# Altium project IIOT_GATEWAY_MT7621.PrjPcb (part 1 of 2)
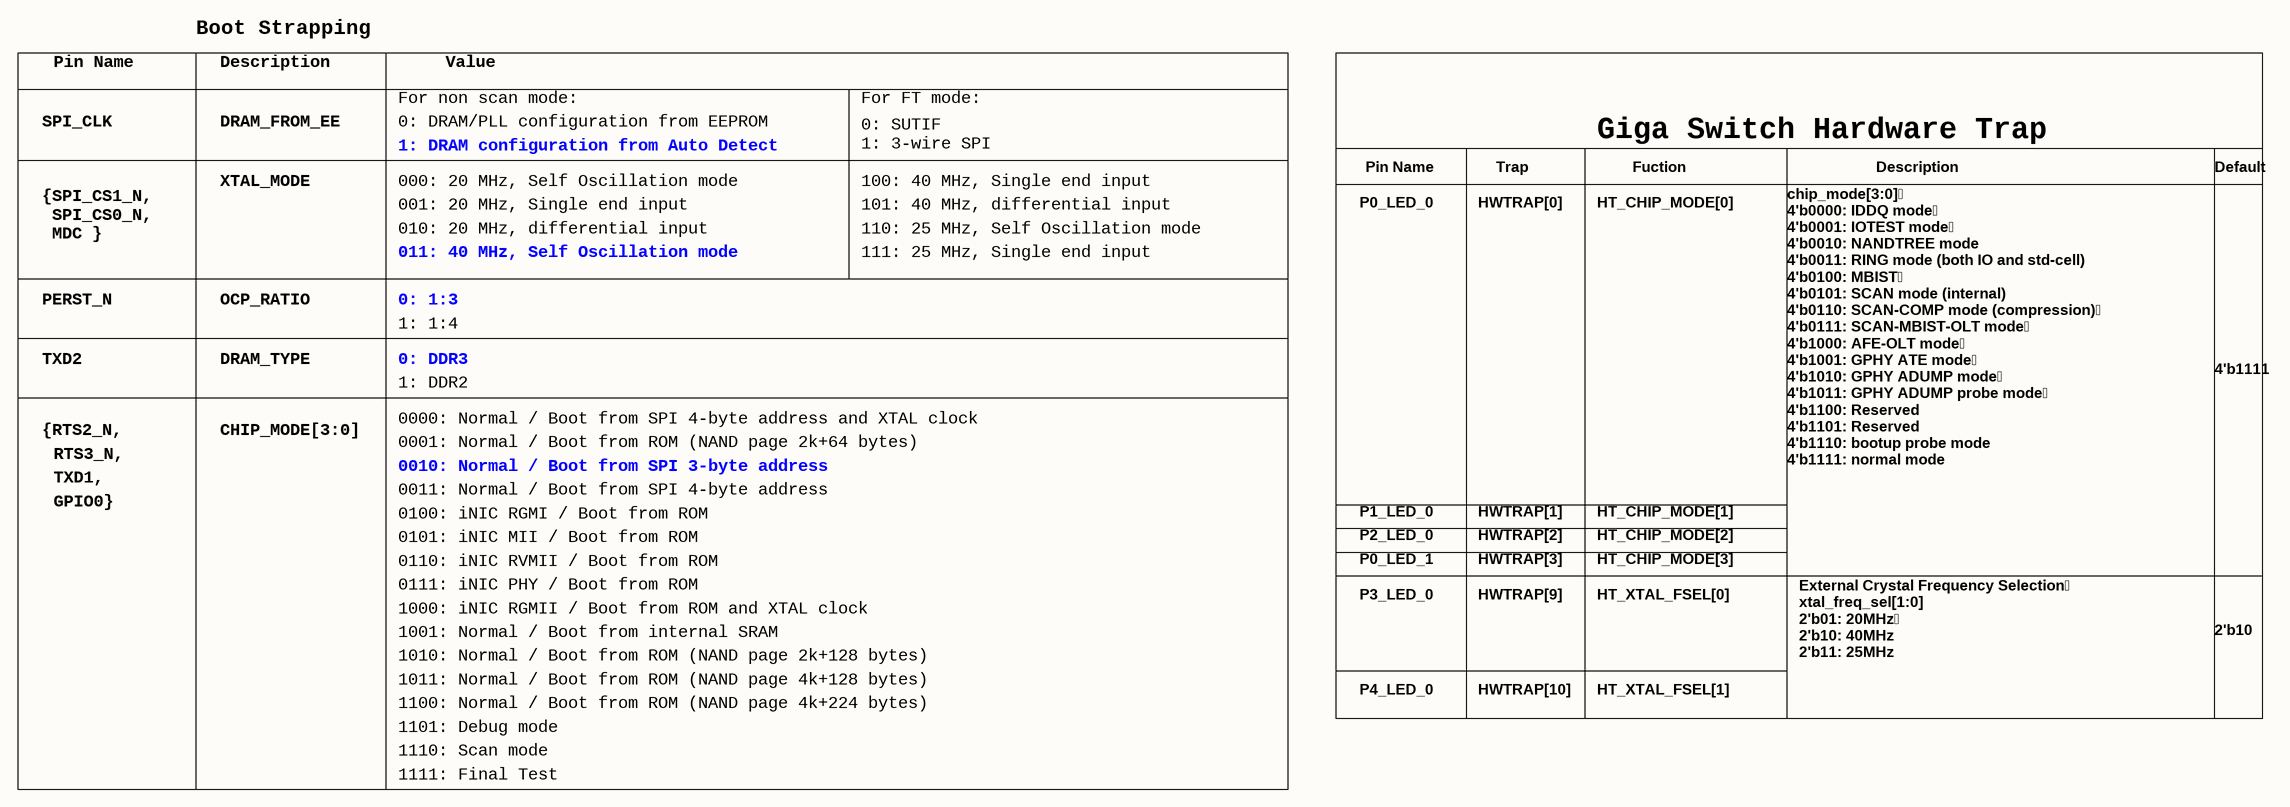
[diagram p0: Config.SchDoc]
9 sheets, 340 parts. Net scope: global (net labels, ports and power ports of the same name join across sheets).
Board file: IIOT_GATEWAY_MT7621.PcbDoc
Sheets:
  Config.SchDoc
  DC_DC_ISO.SchDoc
  PMU.SchDoc
  TRANSFORMER_RJ45.SchDoc
  USB3.0_Console.SchDoc
  uSD.SchDoc
  PCIe to SATA.SchDoc
  PCIe Slot.SchDoc
  RS485.SchDoc

## Sheet Config.SchDoc
size 513 x 386 mm

### Notes on the sheet
- Pin Name
- Boot Strapping
- Description
- Value
- SPI_CLK
- DRAM_FROM_EE
- For non scan mode:
- 0: DRAM/PLL configuration from EEPROM
- For FT mode:
- XTAL_MODE
- 1: DRAM configuration from Auto Detect
- 000: 20 MHz, Self Oscillation mode
- 100: 40 MHz, Single end input
- 0: SUTIF
  1: 3-wire SPI
- Trap
- Giga Switch Hardware Trap
- Fuction
- Default
- {SPI_CS1_N,
  SPI_CS0_N,
  MDC }
- 001: 20 MHz, Single end input
- 010: 20 MHz, differential input
- 101: 40 MHz, differential input
- 110: 25 MHz, Self Oscillation mode
- P0_LED_0
- HWTRAP[0]
- HT_CHIP_MODE[0]
- PERST_N
- OCP_RATIO
- 0: 1:3
- 011: 40 MHz, Self Oscillation mode
- 111: 25 MHz, Single end input
- TXD2
- DRAM_TYPE
- 0: DDR3
- 1: 1:4
- 4'b1111
- 1: DDR2
- 0000: Normal / Boot from SPI 4-byte address and XTAL clock
- {RTS2_N,
- RTS3_N,
- TXD1,
- CHIP_MODE[3:0]
- 0001: Normal / Boot from ROM (NAND page 2k+64 bytes)
- 0010: Normal / Boot from SPI 3-byte address
- chip_mode[3:0]
  4'b0000: IDDQ mode
  4'b0001: IOTEST mode
  4'b0010: NANDTREE mode
  4'b0011: RING mode (both IO and std-cell)
  4'b0100: MBIST
  4'b0101: SCAN mode (internal)
  4'b0110: SCAN-COMP mode (compression)
  4'b0111: SCAN-MBIST-OLT mode
  4'b1000: AFE-OLT mode
  4'b1001: GPHY ATE mode
  4'b1010: GPHY ADUMP mode
  4'b1011: GPHY ADUMP probe mode
  4'b1100: Reserved
  4'b1101: Reserved
  4'b1110: bootup probe mode
  4'b1111: normal mode
- GPIO0}
- 0011: Normal / Boot from SPI 4-byte address
- 0100: iNIC RGMI / Boot from ROM
- 0101: iNIC MII / Boot from ROM
- P1_LED_0
- P2_LED_0
- HWTRAP[1]
- HWTRAP[2]
- HT_CHIP_MODE[2]
- HT_CHIP_MODE[1]
- 0111: iNIC PHY / Boot from ROM
- 0110: iNIC RVMII / Boot from ROM
- P0_LED_1
- P3_LED_0
- HWTRAP[9]
- HWTRAP[3]
- HT_XTAL_FSEL[0]
- HT_CHIP_MODE[3]
- 1000: iNIC RGMII / Boot from ROM and XTAL clock
- 1001: Normal / Boot from internal SRAM
- 1010: Normal / Boot from ROM (NAND page 2k+128 bytes)
- External Crystal Frequency Selection
  xtal_freq_sel[1:0]
  2'b01: 20MHz
  2'b10: 40MHz
  2'b11: 25MHz
- 2'b10
- 1100: Normal / Boot from ROM (NAND page 4k+224 bytes)
- 1011: Normal / Boot from ROM (NAND page 4k+128 bytes)
- P4_LED_0
- HWTRAP[10]
- HT_XTAL_FSEL[1]
- 1101: Debug mode
- 1110: Scan mode
- 1111: Final Test

## Sheet DC_DC_ISO.SchDoc
size Legal
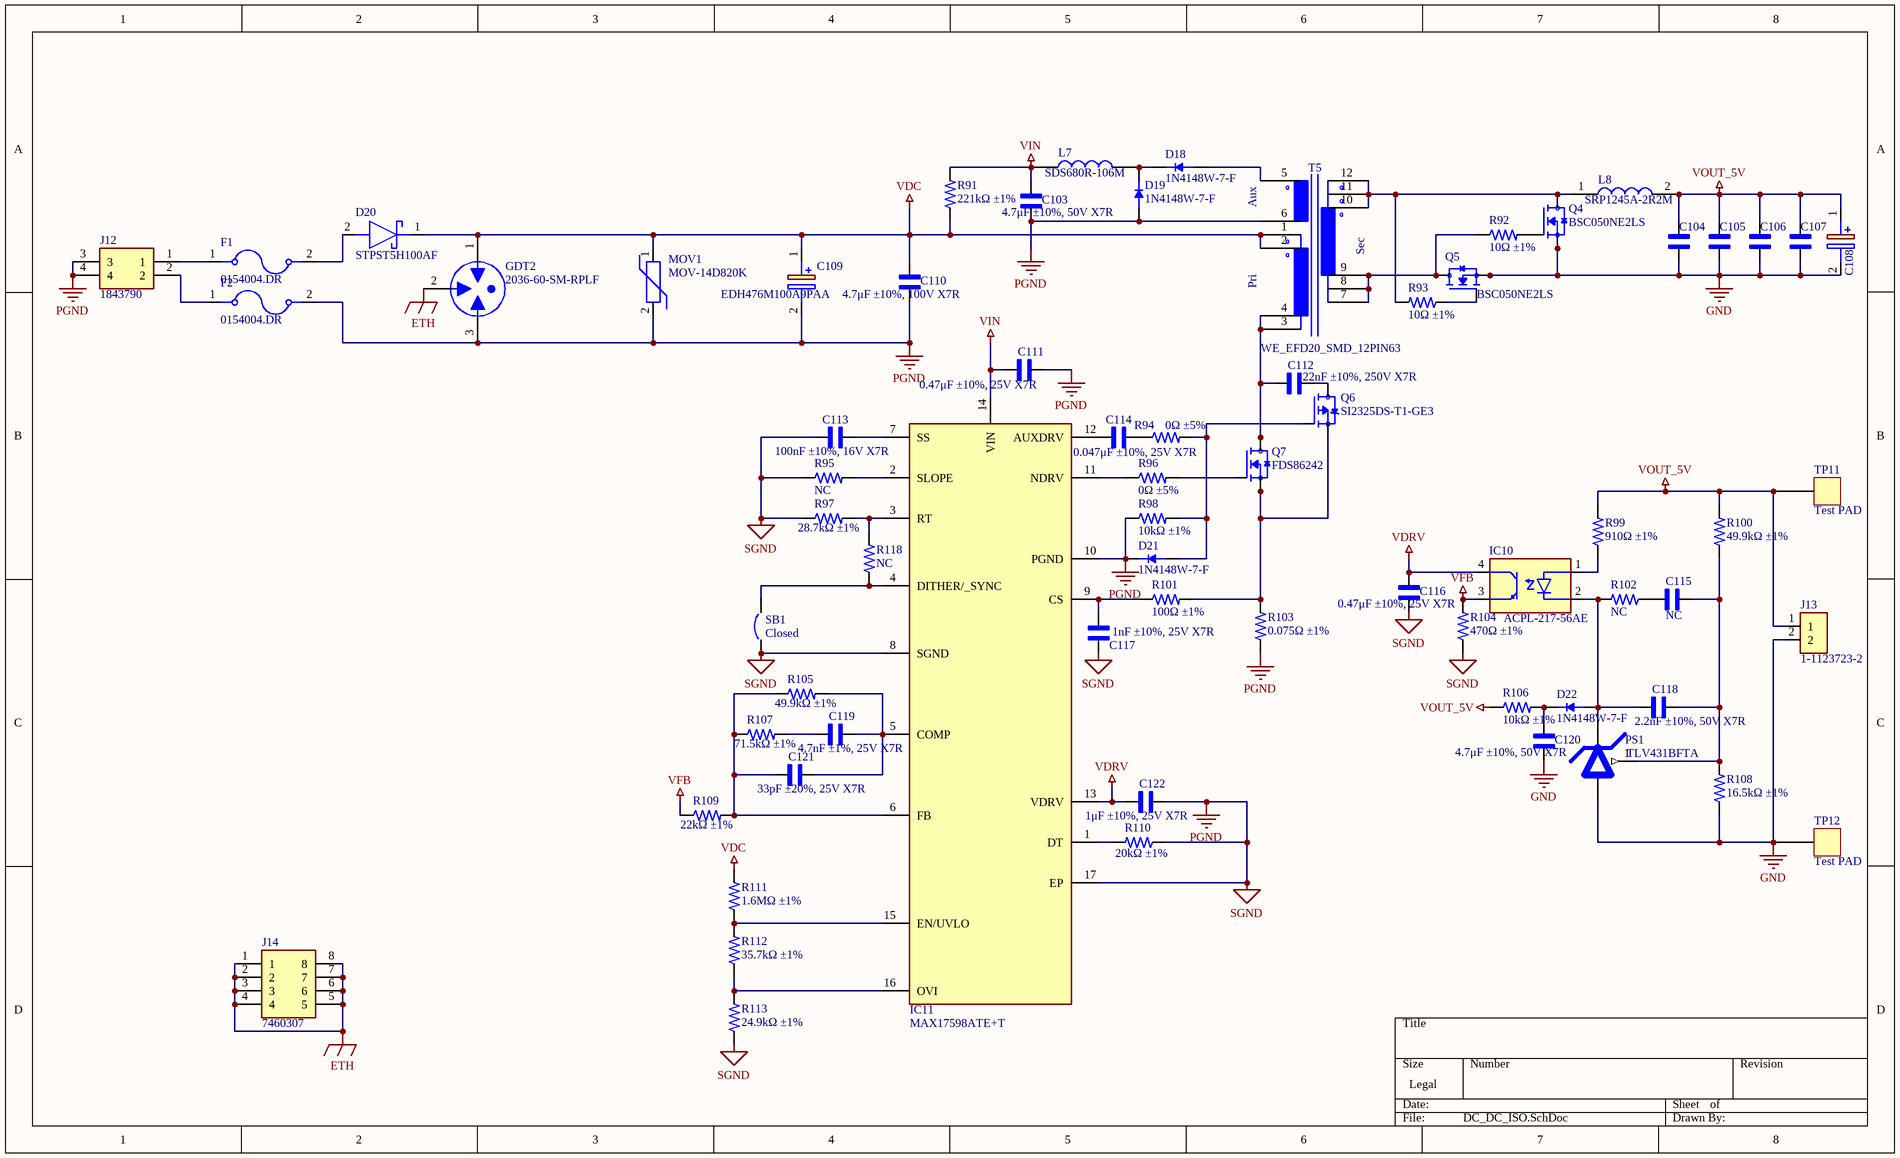
[diagram p1: DC_DC_ISO.SchDoc]

### Parts
C103  4.7μF ±10%, 50V X7R  [1206_C]
C104  47μF ±10%, 10V X7R  [1210_C]  (value not drawn)
C105  47μF ±10%, 10V X7R  [1210_C]  (value not drawn)
C106  47μF ±10%, 10V X7R  [1210_C]  (value not drawn)
C107  47μF ±10%, 10V X7R  [1210_C]  (value not drawn)
C108  TCJ5477M016R0100E/NI  [CAPPM7344X400N]  (value not drawn)
C109  EDH476M100A9PAA  [CAPAE1030X1050N]
C110  4.7μF ±10%, 100V X7R  [1210_C]
C111  0.47μF ±10%, 25V X7R  [0603_C]
C112  22nF ±10%, 250V X7R  [0805_C]
C113  100nF ±10%, 16V X7R  [0603_C]
C114  0.047μF ±10%, 25V X7R  [0603_C]
C115  NC  [0603_C]
C116  0.47μF ±10%, 25V X7R  [0603_C]
C117  1nF ±10%, 25V X7R  [0603_C]
C118  2.2nF ±10%, 50V X7R  [0603_C]
C119  4.7nF ±1%, 25V X7R  [0603_C]
C120  4.7μF ±10%, 50V X7R  [1206_C]
C121  33pF ±20%, 25V X7R  [0603_C]
C122  1μF ±10%, 25V X7R  [0805_C]
D18  1N4148W-7-F  [SOD3715X135N]
D19  1N4148W-7-F  [SOD3715X135N]
D20  STPST5H100AF  [SODFL4724X103N]
D21  1N4148W-7-F  [SOD3715X135N]
D22  1N4148W-7-F  [SOD3715X135N]
F1  0154004.DR  [FUSE_0154004.DR]
F2  0154004.DR  [FUSE_0154004.DR]
GDT2  2036-60-SM-RPLF  [2036-60-SM-RPLF]
IC10  ACPL-217-56AE  [SOIC127P700X242-4N]
IC11  MAX17598ATE+T  [QFN50P300X300X80-17N]
J12  1843790  [1843790]
J13  1-1123723-2  [TE_1-1123723-2]
J14  7460307  [7460307]
L7  SDS680R-106M  [SRR6603332ML]
L8  SRP1245A-2R2M  [INDPM135125X500N]
MOV1  MOV-14D820K  [MOV-14D820K]
PS1  TLV431BFTA  [SOT96P240X100-3N]
Q4  BSC050NE2LS  [BSC050NE2LS]
Q5  BSC050NE2LS  [BSC050NE2LS]
Q6  SI2325DS-T1-GE3  [SOT-23]
Q7  FDS86242  [SOIC127P600X175-8N]
R91  221kΩ ±1%  [0805_R]
R92  10Ω ±1%  [0603_R]
R93  10Ω ±1%  [0603_R]
R94  0Ω ±5%  [0603_R]
R95  NC  [0603_R]
R96  0Ω ±5%  [0603_R]
R97  28.7kΩ ±1%  [0603_R]
R98  10kΩ ±1%  [0603_R]
R99  910Ω ±1%  [0603_R]
R100  49.9kΩ ±1%  [0603_R]
R101  100Ω ±1%  [0603_R]
R102  NC  [0603_R]
R103  0.075Ω ±1%  [1206_R]
R104  470Ω ±1%  [0603_R]
R105  49.9kΩ ±1%  [0603_R]
R106  10kΩ ±1%  [0603_R]
R107  71.5kΩ ±1%  [0603_R]
R108  16.5kΩ ±1%  [0603_R]
R109  22kΩ ±1%  [0603_R]
R110  20kΩ ±1%  [0603_R]
R111  1.6MΩ ±1%  [0805_R]
R112  35.7kΩ ±1%  [0603_R]
R113  24.9kΩ ±1%  [0603_R]
R118  NC  [0603_R]
SB1  Closed  [SB_0603]
T5  WE_EFD20_SMD_12PIN63  [WE_EFD20_SMD_12PIN63]
TP11  Test PAD  [Test PAD]
TP12  Test PAD  [Test PAD]

### Nets
ETH: GDT2.2(E) J14.1 J14.2 J14.3 J14.4 J14.5 J14.6 J14.7 J14.8
GND: C104.2 C105.2 C106.2 C107.2 C108.2(-) C120.2 J13.2 PS1.3(ANODE) Q4.1(S) Q4.2(S) Q4.3(S) Q5.1(S) Q5.2(S) Q5.3(S) R108.1 TP12.1
PGND: C103.2 C109.2(-) C110.2 C111.2 C113.1 C116.2 C117.2 C122.2 D19.A D21.C(K) F2.2 GDT2.3(B) IC11.8(SGND) IC11.10(PGND) IC11.17(EP) J12.3 J12.4 MOV1.2 R95.1 R97.1 R98.1 R103.1 R104.1 R110.1 R113.1 SB1.1 T5.6  [also labelled SGND]
VDC: C109.1(+) C110.1 D20.1(K) GDT2.1(A) MOV1.1 R91.1 R111.2 T5.1 T5.2
VDRV: C116.1 C122.1 IC10.4(COLLECTOR) IC11.13(VDRV)
VFB: IC10.3(EMITTER) R104.2 R109.1
VIN: C103.1 C111.1 IC11.14(VIN) L7.1 R91.2
VOUT_5V: C104.1 C105.1 C106.1 C107.1 C108.1(+) J13.1 L8.2 R99.2 R100.2 R106.1 TP11.1
NetC112_1: C112.1 Q6.3(D)
NetC112_2: C112.2 Q7.5(D) Q7.6(D) Q7.7(D) Q7.8(D) T5.3 T5.4
NetC113_2: C113.2 IC11.7(SS)
NetC114_1: C114.1 R94.1
NetC114_2: C114.2 IC11.12(AUXDRV)
NetC115_1: C115.1 C118.1 PS1.1(REF) R100.1 R108.2
NetC115_2: C115.2 R102.1
NetC117_1: C117.1 IC11.9(CS) R101.1
NetC118_2: C118.2 D22.A IC10.2(CATHODE) PS1.2(CATHODE) R102.2
NetC119_1: C119.1 R107.2
NetC119_2: C119.2 C121.2 IC11.5(COMP) R105.2
NetC120_1: C120.1 D22.C(K) R106.2
NetC121_1: C121.1 IC11.6(FB) R105.1 R107.1 R109.2
NetD18_A: D18.A T5.5
NetD18_C: D18.C(K) D19.C(K) L7.2
NetD20_2: D20.2(A) F1.2
NetD21_A: D21.A Q6.1(G) R94.2 R98.2
NetF1_1: F1.1 J12.1
NetF2_1: F2.1 J12.2
NetIC10_1: IC10.1(ANODE) R99.1
NetIC11_1: IC11.1(DT) R110.2
NetIC11_2: IC11.2(SLOPE) R95.2
NetIC11_3: IC11.3(RT) R97.2 R118.2
NetIC11_4: IC11.4(DITHER/_SYNC) R118.1 SB1.2
NetIC11_11: IC11.11(NDRV) R96.1
NetIC11_15: IC11.15(EN/UVLO) R111.1 R112.2
NetIC11_16: IC11.16(OVI) R112.1 R113.2
NetL8_1: L8.1 Q4.5(D) Q4.6(D) Q4.7(D) Q4.8(D) Q4.9(D) R93.2 T5.10 T5.11 T5.12
NetQ4_4: Q4.4(G) R92.2
NetQ5_4: Q5.4(G) R93.1
NetQ5_5: Q5.5(D) Q5.6(D) Q5.7(D) Q5.8(D) Q5.9(D) R92.1 T5.7 T5.8 T5.9
NetQ6_2: Q6.2(S) Q7.1(S) Q7.2(S) Q7.3(S) R101.2 R103.2
NetQ7_4: Q7.4(G) R96.2

### Notes on the sheet
- (in symbol WE_EFD20_SMD_12PIN63) Aux; Sec; Pri

### Library data of the parts
C103 C110-C122 = CAP: MP: LD03ZD475MAB2A; Package: None; Price: None; Value: *; Availability: Unavailable
C104-C107 = CAP: Capacitor non polar; MP: LD03ZD475MAB2A; Package: None; Price: None; Value: *; Availability: Unavailable
C108 = TCJ5477M016R0100E: Capacitor Polarised; Manufacturer_Name: AVX; Datasheet Link: https://datasheets.kyocera-avx.com/TCJ.pdf; Height: 4mm; Manufacturer_Part_Number: TCJ5477M016R0100E; Mouser Part Number: 581-TCJ5477M016R100E; Mouser Price/Stock: https://www.mouser.co.uk/ProductDetail/AVX/TCJ5477M016R0100E?qs=hWgE7mdIu5QV3CO1kSXQRw%3D%3D
C109 = EDH476M100A9PAA: Capacitor Polarised; Manufacturer_Name: KEMET; Datasheet Link: https://content.kemet.com/datasheets/KEM_A4049_EDH.pdf; Height: 10.5mm; Manufacturer_Part_Number: EDH476M100A9PAA; Mouser Part Number: 80-EDH476M100A9PAA; Mouser Price/Stock: https://www.mouser.co.uk/ProductDetail/KEMET/EDH476M100A9PAA?qs=E9QF1UCAUX7o%252BSuv4vgBDA%3D%3D; Arrow Part Number: EDH476M100A9PAA; Arrow Price/Stock: https://www.arrow.com/en/products/edh476m100a9paa/kemet-corporation?region=nac
D18 D19 D21 D22 = 1N4148W-7-F: Diode Standard 100 V 300mA (DC) Surface Mount SOD-123; MF: Diodes Inc.; Value: *; Availability: In Stock; Package: SOD-123 Fairchild Semiconductor; SnapEDA_Link: https://www.snapeda.com/parts/1N4148W-7-F/Diodes+Inc./view-part/?ref=snap; Price: None; Check_prices: https://www.snapeda.com/parts/1N4148W-7-F/Diodes+Inc./view-part/?ref=eda; Purchase-URL: https://pricing.snapeda.com/search/part/1N4148W-7-F/?ref=eda; MP: 1N4148W-7-F
D20 = STPST5H100AF: Schottky Diode; Manufacturer_Name: STMicroelectronics; Datasheet Link: https://www.st.com/resource/en/datasheet/stpst5h100.pdf; Height: 1.03mm; Manufacturer_Part_Number: STPST5H100AF; Mouser Part Number: 511-STPST5H100AF; Mouser Price/Stock: https://www.mouser.co.uk/ProductDetail/STMicroelectronics/STPST5H100AF?qs=Jm2GQyTW%2Fbg40alT%252BULHUw%3D%3D
F1 F2 = 0154004.DR: 154/154T/154L/154TL Series OMNI-BLOKÂ® Fuse and Holder Assembly; Package: None; Availability: Unavailable; Value: *; MP: 0154004.DR; Price: None
GDT2 = 2036-60-SM-RPLF: Gas Discharge Tubes - GDTs / Gas Plasma Arrestors Sparkover100V/s 600V Miniature 3 Pole
IC10 = ACPL-217-56AE: Integrated Circuit; Manufacturer_Name: Avago Technologies; Datasheet Link: https://docs.broadcom.com/docs/AV02-0470EN; Height: 2.42mm; Manufacturer_Part_Number: ACPL-217-56AE; Mouser Part Number: 630-ACPL-217-56AE; Mouser Price/Stock: https://www.mouser.co.uk/ProductDetail/Broadcom-Avago/ACPL-217-56AE?qs=dcm2zoLQumBcA1gigmq0vA%3D%3D
IC11 = MAX17598ATE+T: Integrated Circuit; Manufacturer_Name: Analog Devices; Datasheet Link: https://www.mouser.in/datasheet/2/256/MAX17599-1513910.pdf; Height: 0.8mm; Manufacturer_Part_Number: MAX17598ATE+T; Mouser Part Number: 700-MAX17598ATE+T; Mouser Price/Stock: https://www.mouser.co.uk/ProductDetail/Maxim-Integrated/MAX17598ATE%2bT?qs=0JU57JYmZjvlV4vexIaXHA%3D%3D; Arrow Part Number: MAX17598ATE+T; Arrow Price/Stock: https://www.arrow.com/en/products/max17598atet/maxim-integrated?region=nac
J12 = 1843790: Connector; Manufacturer_Name: Phoenix Contact; Datasheet Link: http://www.phoenixcontact.com/de/produkte/1843790/pdf; Height: 7.4mm; Manufacturer_Part_Number: 1843790; Mouser Part Number: 651-1843790; Mouser Price/Stock: https://www.mouser.co.uk/ProductDetail/Phoenix-Contact/1843790?qs=8BCRtFWWXOSOfz2GfgipZg%3D%3D; Arrow Part Number: 1843790; Arrow Price/Stock: https://www.arrow.com/en/products/1843790/phoenix-contact?region=nac
J13 = 1-1123723-2: 3.96 EP HDR ASSY 2P_NATURAL_; Number_of_Positions: 2; MF: TE Connectivity; Product_Type: Header; Centerline_Pitch: 3.96 mm[.156 in]; EU_RoHS_Compliance: Compliant; Value: *; TE_purchase_URL: https://www.te.com/usa-en/product-1-1123723-2.html?te_bu=Cor&te_type=disp&te_campaign=seda_glo_cor-seda-global-disp-prtnr-fy19-seda-model-bom-cta_sma-317_1&elqCampaignId=32493; SnapEDA_Link: https://www.snapeda.com/parts/1-1123723-2/TE%20Connectivity%20AMP%20Connectors/view-part/231687/?ref=snap; Package: None; MP: 1-1123723-2; Digi-Key_Purchase_URL: https://www.digikey.com/product-detail/en/te-connectivity-amp-connectors/1-1123723-2/A111830-ND/686925?utm_source=snapeda&utm_medium=aggregator&utm_campaign=symbol; Digi-Key_Part_Number: A111830-ND
J14 = 7460307: Connector; Manufacturer_Name: Wurth Elektronik; Datasheet Link: https://katalog.we-online.com/em/datasheet/7460307.pdf; Height: 7mm; Manufacturer_Part_Number: 7460307; Mouser Part Number: 710-7460307; Mouser Price/Stock: https://www.mouser.co.uk/ProductDetail/Wurth-Elektronik/7460307?qs=lykWx4dhCCG1TLZtVq%252B8cQ%3D%3D
L7 = SDS680R-106M: Inductor 10mH; Manufacturer_Name: Bourns; Manufacturer_Part_Number: SRR6603-103ML; Datasheet Link: https://www.bourns.com/docs/Product-Datasheets/SRR6603.pdf; Height: 3mm; Mouser Part Number: 652-SRR6603-103ML; Mouser Price/Stock: https://www.mouser.co.uk/ProductDetail/Bourns/SRR6603-103ML?qs=Nb99Pa9xYq%252Bz9Mktch6%252BTg%3D%3D; Arrow Part Number: SRR6603-103ML; Arrow Price/Stock: https://www.arrow.com/en/products/srr6603-103ml/bourns
L8 = SRP1245A-2R2M: Inductor 2.2uH; Manufacturer_Name: Bourns; Datasheet Link: https://www.bourns.com/docs/Product-Datasheets/SRP1245A.pdf; Height: 5mm; Manufacturer_Part_Number: SRP1245A-2R2M; Mouser Part Number: 652-SRP1245A-2R2M; Mouser Price/Stock: https://www.mouser.co.uk/ProductDetail/Bourns/SRP1245A-2R2M?qs=7z%252BmIopC6%2FIfpuWA3q0S0Q%3D%3D; Arrow Part Number: SRP1245A-2R2M; Arrow Price/Stock: https://www.arrow.com/en/products/srp1245a-2r2m/bourns?region=nac
MOV1 = MOV-14D820K: Varistors 82volts 14mm; MP: MOV-14D471K; MF: Bourns; Price: None; SnapEDA_Link: https://www.snapeda.com/parts/MOV-14D471K/Bourns/view-part/?ref=snap; Package: Disc-14 Bourns; Availability: In Stock; Check_prices: https://www.snapeda.com/parts/MOV-14D471K/Bourns/view-part/?ref=eda; Purchase-URL: https://pricing.snapeda.com/search/part/MOV-14D471K/?ref=eda; Value: *
PS1 = TLV431BFTA: Power Supply; Manufacturer_Name: Diodes Inc.; Datasheet Link: https://www.diodes.com/assets/Datasheets/TLV431.pdf; Height: 1mm; Manufacturer_Part_Number: TLV431BFTA; Mouser Part Number: 621-TLV431BFTA; Mouser Price/Stock: https://www.mouser.co.uk/ProductDetail/Diodes-Incorporated/TLV431BFTA?qs=nSryOFbzj8KLzVR2LsCcOA%3D%3D; Arrow Part Number: TLV431BFTA; Arrow Price/Stock: https://www.arrow.com/en/products/tlv431bfta/diodes-incorporated?region=europe
Q4 Q5 = BSC050NE2LS: MOSFET (N-Channel); Manufacturer_Name: Infineon; Datasheet Link: https://www.infineon.com/dgdl/Infineon-BSC050NE2LS-DataSheet-v02_04-EN.pdf?fileId=db3a304326dfb1300126fb5ce0cb3f2d; Height: 1.2mm; Manufacturer_Part_Number: BSC050NE2LS; Mouser Part Number: 726-BSC050NE2LS; Mouser Price/Stock: https://www.mouser.co.uk/ProductDetail/Infineon-Technologies/BSC050NE2LS?qs=HwMeRNENlMaXFFR8DpmvKQ%3D%3D
Q6 = SI2325DS-T1-GE3: 150V 0.69A 1.25W 1.2ohm at 10V; MF: Vishay Siliconix; SnapEDA_Link: https://www.snapeda.com/parts/SI2325DS-T1-GE3/Vishay+Siliconix/view-part/?ref=snap; Package: SOT-23-3 Vishay Siliconix; Value: *; MP: SI2325DS-T1-GE3; Check_prices: https://www.snapeda.com/parts/SI2325DS-T1-GE3/Vishay+Siliconix/view-part/?ref=eda
Q7 = FDS86242: Integrated Circuit; Manufacturer_Name: onsemi; Datasheet Link: https://datasheet.datasheetarchive.com/originals/distributors/Datasheets_SAMA/beddb12da8e05a49ab7133607c08bb07.pdf; Height: 1.75mm; Manufacturer_Part_Number: FDS86242; Mouser Part Number: 512-FDS86242; Mouser Price/Stock: https://www.mouser.co.uk/ProductDetail/ON-Semiconductor-Fairchild/FDS86242?qs=WZYOKEqGBpJo60pi1Jf2hA%3D%3D; Arrow Part Number: FDS86242; Arrow Price/Stock: https://www.arrow.com/en/products/fds86242/on-semiconductor
R91-R113 R118 = RES: MP: 3-1879460-6; Package: None; Price: None; Value: *; Availability: Unavailable
SB1 = Circuit Breaker_close: Circuit Breaker; Published: 24-Mar-1999; Revision: July-2002: Re-released for DXP Platform.; Publisher: Altium Limited
T5 = WE_EFD20_SMD_12PIN63: Transformer; Manufacturer_Name: Wurth Elektronik; Manufacturer_Part_Number: 7491194912; Mouser Part Number: 710-7491194912; Mouser Price/Stock: https://www.mouser.co.uk/ProductDetail/Wurth-Elektronik/7491194912?qs=PGXP4M47uW77qoYmvw4NKA%3D%3D

## Sheet PMU.SchDoc
size C
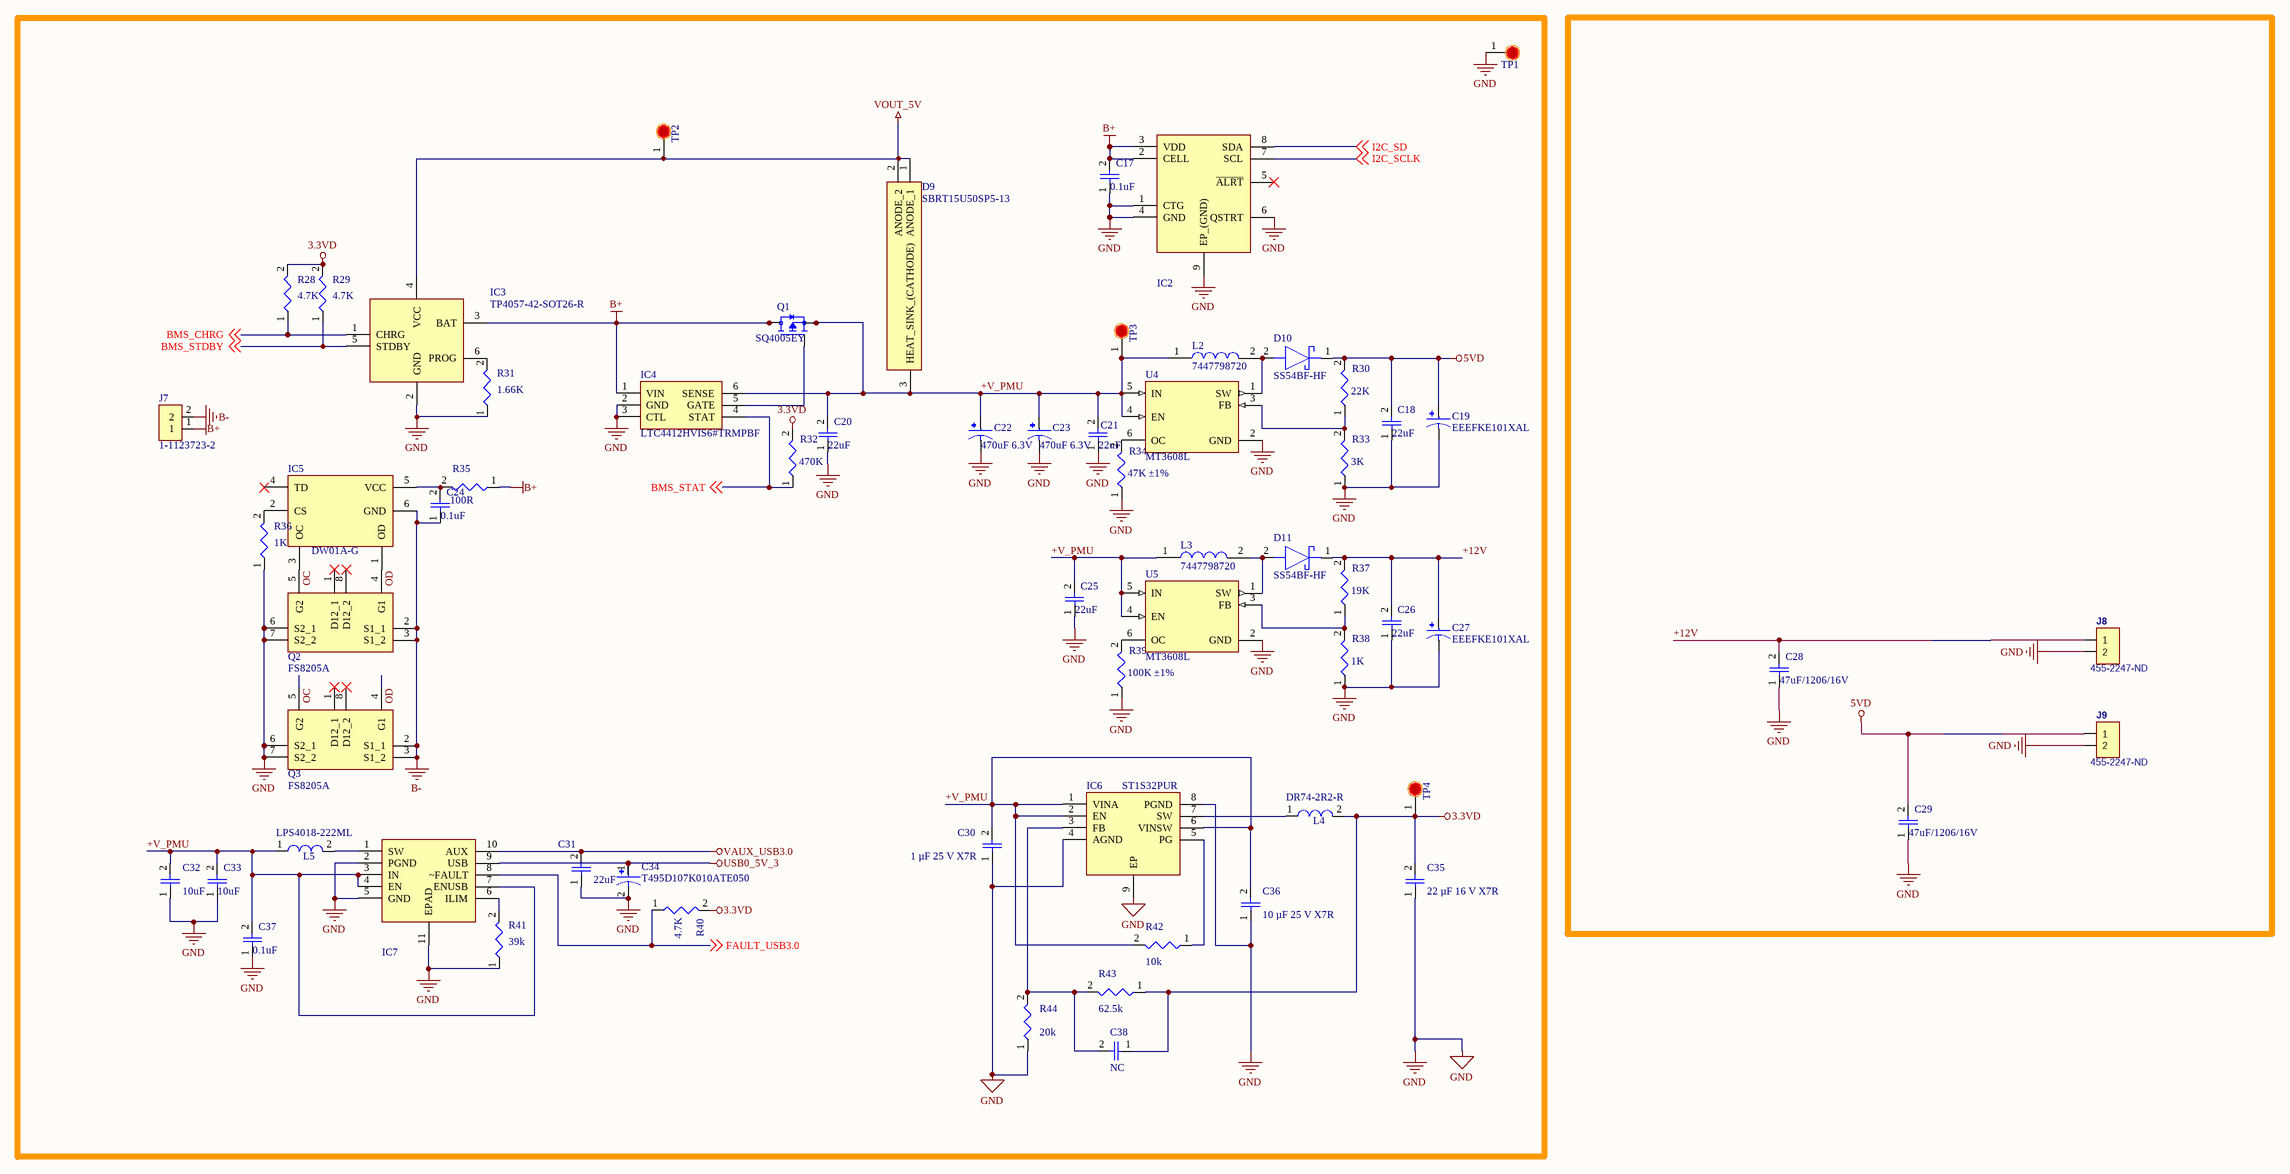
[diagram p2: PMU.SchDoc]

### Parts
C17  0.1uF  [0603-C]
C18  22uF  [1206-C]
C19  EEEFKE101XAL  [CAP_EEEFKE101XAL]
C20  22uF  [0603-C]
C21  22uF  [0603-C]
C22  470uF 6.3V  [CAP_EEEFK0J471P]
C23  470uF 6.3V  [CAP_EEEFK0J471P]
C24  0.1uF  [0603-C]
C25  22uF  [0603-C]
C26  22uF  [1206-C]
C27  EEEFKE101XAL  [CAP_EEEFKE101XAL]
C28  47uF/1206/16V  [1206-C]
C29  47uF/1206/16V  [1206-C]
C30  1 µF 25 V X7R  [0603-C]
C31  22uF  [1210-C]
C32  10uF  [1210-C]
C33  10uF  [0805-C]
C34  T495D107K010ATE050  [CAP_4TAE470ML]
C35  22 µF 16 V X7R  [1210-C]
C36  10 µF 25 V X7R  [1210-C]
C37  0.1uF  [0603-C]
C38  NC  [0603-C]
D9  SBRT15U50SP5-13  [POWERDI5]
D10  SS54BF-HF  [SODFL5336X130N]
D11  SS54BF-HF  [SODFL5336X130N]
IC2  MAX17048G+T10  [SON50P200X200X80-9N-D]  (value not drawn)
IC3  TP4057-42-SOT26-R  [SOT95P280X125-6N]
IC4  LTC4412HVIS6#TRMPBF  [SOT95P280X100-6N]
IC5  DW01A-G  [SOT95P280X135-6N]
IC6  ST1S32PUR  [SON80P400X400X100-9N-D]
IC7  TPS2500DRCT  [SON50P300X300X100-11N]  (value not drawn)
J7  1-1123723-2  [TE_1-1123723-2]
J8  455-2247-ND  [CON_HDR1x2]
J9  455-2247-ND  [CON_HDR1x2]
L2  7447798720  [CDRH103RNP6R8NCB]
L3  7447798720  [CDRH103RNP6R8NCB]
L4  DR74-2R2-R  [INDM7676X435N]
L5  LPS4018-222ML  [VLC5045]
Q1  SQ4005EY  [SOIC127P600X175-8N]
Q2  FS8205A  [SOP65P640X120-8N]
Q3  FS8205A  [SOP65P640X120-8N]
R28  4.7K  [0402-R]
R29  4.7K  [0402-R]
R30  22K  [0603-R]
R31  1.66K  [0603-R]
R32  470K  [0402-R]
R33  3K  [0603-R]
R34  47K ±1%  [0603-R]
R35  100R  [0603-R]
R36  1K  [0603-R]
R37  19K  [0603-R]
R38  1K  [0603-R]
R39  100K ±1%  [0603-R]
R40  4.7K  [0402-R]
R41  39k  [0603-R]
R42  10k  [0603-R]
R43  62.5k  [0603-R]
R44  20k  [0603-R]
TP1  TP  [TP_SMD]  (value not drawn)
TP2  TP  [TP_SMD]  (value not drawn)
TP3  TP  [TP_SMD]  (value not drawn)
TP4  TP  [TP_SMD]  (value not drawn)
U4  MT3608L  [SOT95P280X145-6N]
U5  MT3608L  [SOT95P280X145-6N]

### Nets
3.3VD: C35.2 C38.1 L4.2 R28.2 R29.2 R32.2 R40.2 R43.1 TP4.1
5VD: C18.2 C19.1 C29.2 D10.1(K) J9.1 R30.2
B+: C17.2 IC2.2(CELL) IC2.3(VDD) IC3.3(BAT) IC4.1(VIN) J7.1 Q1.5(D) Q1.6(D) Q1.7(D) Q1.8(D) R35.1
B-: C24.1 IC5.6(GND) J7.2 Q2.2(S1_1) Q2.3(S1_2) Q3.2(S1_1) Q3.3(S1_2)
GND: C17.1 C18.1 C19.2 C20.1 C21.1 C22.2 C23.2 C25.1 C26.1 C27.2 C28.1 C29.1 C30.1 C31.1 C32.1 C33.1 C34.2 C35.1 C36.1 C37.1 IC2.1(CTG) IC2.4(GND) IC2.6(QSTRT) IC2.9(EP_(GND)) IC3.2(GND) IC4.2(GND) IC4.3(CTL) IC6.4(AGND) IC6.8(PGND) IC6.9(EP) IC7.2(PGND) IC7.5(GND) IC7.11(EPAD) J8.2 J9.2 Q2.6(S2_1) Q2.7(S2_2) Q3.6(S2_1) Q3.7(S2_2) R31.1 R33.1 R34.1 R36.1 R38.1 R39.1 R41.1 R44.1 TP1.1 U4.2(GND) U5.2(GND)
USB0_5V_3: C34.1 IC7.9(USB)
VAUX_USB3.0: C31.2 IC7.10(AUX)
VOUT_5V: D9.1(ANODE_1) D9.2(ANODE_2) IC3.4(VCC) TP2.1
+12V: C26.2 C27.1 C28.2 D11.1(K) J8.1 R37.2
+V_PMU: C20.2 C21.2 C22.1 C23.1 C25.2 C30.2 C32.2 C33.2 C36.2 C37.2 D9.3(HEAT_SINK_(CATHODE)) IC4.6(SENSE) IC6.1(VINA) IC6.2(EN) IC6.6(VINSW) IC7.3(IN) IC7.4(EN) IC7.7(ENUSB) L2.1 L3.1 L5.1 Q1.1(S) Q1.2(S) Q1.3(S) R42.2 TP3.1 U4.4(EN) U4.5(IN) U5.4(EN) U5.5(IN)
BMS_CHRG: IC3.1(CHRG) R28.1 ; off-sheet BMS_CHRG
BMS_STAT: IC4.4(STAT) R32.1 ; off-sheet BMS_STAT
BMS_STDBY: IC3.5(STDBY) R29.1 ; off-sheet BMS_STDBY
FAULT_USB3.0: IC7.8(~FAULT) R40.1 ; off-sheet FAULT_USB3.0
I2C_SCLK: IC2.7(SCL) ; off-sheet I2C_SCLK
I2C_SD: IC2.8(SDA) ; off-sheet I2C_SD
OC: IC5.3(OC) Q2.5(G2) Q3.5(G2)
OD: IC5.1(OD) Q2.4(G1) Q3.4(G1)
NetC24_2: C24.2 IC5.5(VCC) R35.2
NetC38_2: C38.2 IC6.3(FB) R43.2 R44.2
NetD10_2: D10.2(A) L2.2 U4.1(SW)
NetD11_2: D11.2(A) L3.2 U5.1(SW)
NetIC3_6: IC3.6(PROG) R31.2
NetIC4_5: IC4.5(GATE) Q1.4(G)
NetIC5_2: IC5.2(CS) R36.2
NetIC6_5: IC6.5(PG) R42.1
NetIC6_7: IC6.7(SW) L4.1
NetIC7_1: IC7.1(SW) L5.2
NetIC7_6: IC7.6(ILIM) R41.2
NetR30_1: R30.1 R33.2 U4.3(FB)
NetR34_2: R34.2 U4.6(OC)
NetR37_1: R37.1 R38.2 U5.3(FB)
NetR39_2: R39.2 U5.6(OC)

Not connected (* = marked no-connect by the designer): IC2 5(~{ALRT})*; IC5 4(TD)*; Q2 1(D12_1)* 8(D12_2)*; Q3 1(D12_1)* 8(D12_2)*

### Library data of the parts
C17 C18 C20 C21 C24-C26 C28-C33 C35-C38 = CAP
C19 C27 = EEEFKE101XAL: CAP ALUM 100UF 20% 25V SMD; MF: Panasonic; Check_prices: https://www.snapeda.com/parts/EEEFKE101XAL/Panasonic/view-part/5785135/?ref=eda; Package: RADIAL-2 Panasonic; Value: *; Digi-Key_Part_Number: 10-EEE-FKE101XALCT-ND; MP: EEEFKE101XAL; SnapEDA_Link: https://www.snapeda.com/parts/EEEFKE101XAL/Panasonic/view-part/5785135/?ref=snap
C22 C23 = EEEFK0J471P
C34 = T495D107K010ATE050: Cap Tant Solid 100uF 10V D CASE 10% (7.3 X 4.3 X 2.8mm) SMD 7343-31 0.05 Ohm 125°C T/R; Manufacturer: KEMET; ESR (Equivalent Series Resistance): 50mR; Polarity: Polar; Life (Hours): 2000Hour; Dissipation Factor: 8%; Supplier 1: Newark; Manufacturer Part Number: T495D107K010ATE050; RoHS: Yes; Category: Tantalum Capacitors; Stock 1: 224; Pricing 1: 1=2.46000, 10=2.00000, 25=1.84000, 50=1.69000, 100=1.53000 (USD); Mount: Surface Mount; Case/Package: 2917; Number of Pins: 2; Case Code (Imperial): 2917; Case Code (Metric): 7343; Min Operating Temperature: -55°C; Max Operating Temperature: 125°C; Packaging: Tape and Reel; Capacitance: 100uF; Tolerance: 10%; Voltage Rating: 10V; Package Quantity: 500; Termination: SMD/SMT; Voltage Rating (DC): 10V; Features: General Purpose; Series: T495; Construction: Flat; Length: 7.3mm; Width: 4.3mm; Height: 3.1mm; Height - Seated (Max): 0.122inch; Depth: 4.3mm; Radiation Hardening: No; REACH SVHC: No SVHC; RoHS Compliant: Yes; ComponentLink1URL: http://www.farnell.com/datasheets/2319914.pdf?src-supplier=Farnell; ComponentLink1Description: http://www.farnell.com/datasheets/2319914.pdf?src-supplier=Farnell; ComponentLink2URL: http://www.mouser.com/ds/2/212/KEM_T2071_T495_COTS-1104607.pdf?src-supplier=Mouser; ComponentLink2Description: http://www.mouser.com/ds/2/212/KEM_T2071_T495_COTS-1104607.pdf?src-supplier=Mouser; ComponentLink3URL: http://www.farnell.com/datasheets/2015705.pdf?src-supplier=Farnell; ComponentLink3Description: http://www.farnell.com/datasheets/2015705.pdf?src-supplier=Farnell; ComponentLink4URL: http://www.farnell.com/datasheets/2015705.pdf?src-supplier=Element14; ComponentLink4Description: http://www.farnell.com/datasheets/2015705.pdf?src-supplier=Element14; ComponentLink5URL: https://api.kemet.com/component-edge/download/datasheet/T495D107K010ASE100.pdf?src-supplier=Digi-Key; ComponentLink5Description: https://api.kemet.com/component-edge/download/datasheet/T495D107K010ASE100.pdf?src-supplier=Digi-Key; ComponentLink6URL: http://www.kemet.com/Lists/ProductCatalog/Attachments/261/KEM_T2009_T495.pdf?src-supplier=Avnet; ComponentLink6Description: http://www.kemet.com/Lists/ProductCatalog/Attachments/261/KEM_T2009_T495.pdf?src-supplier=Avnet; ComponentLink7URL: http://www.kemet.com/kemet/web/homepage/kechome.nsf/weben/1AABD97F96BDDBDA8525795A0050FFCA/$file/KEM_T2009_T495.pdf?src-supplier=Avnet; ComponentLink7Description: http://www.kemet.com/kemet/web/homepage/kechome.nsf/weben/1AABD97F96BDDBDA8525795A0050FFCA/$file/KEM_T2009_T495.pdf?src-supplier=Avnet; ComponentLink8URL: http://www.farnell.com/datasheets/2319914.pdf?src-supplier=Newark; ComponentLink8Description: http://www.farnell.com/datasheets/2319914.pdf?src-supplier=Newark; ComponentLink9URL: http://components.arrow.com/part/dataview/44988739S8665845N7429?src-supplier=Arrow+Electronics; ComponentLink9Description: http://components.arrow.com/part/dataview/44988739S8665845N7429?src-supplier=Arrow+Electronics; Supplier Part Number 1: 77Y7860
D9 = SBRT15U50SP5-13: Diode; Manufacturer_Name: Diodes Inc.; Datasheet Link: http://media.digikey.com/pdf/Data%20Sheets/Diodes%20PDFs/SBRT15U50SP5.pdf; Manufacturer_Part_Number: SBRT15U50SP5-13; Mouser Part Number: 621-SBRT15U50SP5-13; Mouser Price/Stock: https://www.mouser.co.uk/ProductDetail/Diodes-Incorporated/SBRT15U50SP5-13?qs=dZoB6MK9LKNtZyLX7B5L8A%3D%3D; Arrow Part Number: SBRT15U50SP5-13; Arrow Price/Stock: https://www.arrow.com/en/products/sbrt15u50sp5-13/diodes-incorporated?region=nac
D10 D11 = SS54BF-HF: Schottky Diode; Manufacturer_Name: Comchip Technology; Datasheet Link: https://www.mouser.co.uk/datasheet/2/80/20190807092834-2504956.pdf; Height: 1.3mm; Manufacturer_Part_Number: SS54BF-HF; Mouser Part Number: 750-SS54BF-HF; Mouser Price/Stock: https://www.mouser.co.uk/ProductDetail/Comchip-Technology/SS54BF-HF?qs=GBLSl2AkirsPcLFwlU2Ctg%3D%3D; Arrow Part Number: SS54BF-HF; Arrow Price/Stock: https://www.arrow.com/en/products/ss54bf-hf/comchip-technology?region=nac
IC2 = MAX17048G+T10: Integrated Circuit; Manufacturer_Name: Maxim Integrated; Datasheet Link: https://datasheets.maximintegrated.com/en/ds/MAX17048-MAX17049.pdf; Height: 0.8mm; Manufacturer_Part_Number: MAX17048G+T10; Mouser Part Number: 700-MAX17048G+T10; Mouser Price/Stock: https://www.mouser.co.uk/ProductDetail/Maxim-Integrated/MAX17048G%2bT10?qs=D7PJwyCwLAoGnnn8jEPRBQ%3D%3D; Arrow Part Number: MAX17048G+T10; Arrow Price/Stock: https://www.arrow.com/en/products/max17048gt10/maxim-integrated?region=nac
IC3 = TP4057-42-SOT26-R: Integrated Circuit; Manufacturer_Name: Nanjing Extension Microelectronics; Datasheet Link: https://datasheet.lcsc.com/szlcsc/Nanjing-Extension-Microelectronics-TP4057_C12044.pdf; Height: 1.25mm; Manufacturer_Part_Number: TP4057-42-SOT26-R
IC4 = LTC4412HVIS6#TRMPBF: Integrated Circuit; Manufacturer_Name: Linear Technology; Datasheet Link: https://datasheet.datasheetarchive.com/originals/dk/DKDS-14/267243.pdf; Height: 1mm; Manufacturer_Part_Number: LTC4412HVIS6#TRMPBF; Mouser Part Number: 584-C4412HVIS6TRMPBF; Mouser Price/Stock: https://www.mouser.co.uk/ProductDetail/Analog-Devices-Linear-Technology/LTC4412HVIS6TRMPBF?qs=hVkxg5c3xu%2F0qD9zc%2Fd4vw%3D%3D; Arrow Part Number: LTC4412HVIS6#TRMPBF; Arrow Price/Stock: https://www.arrow.com/en/products/ltc4412hvis6trmpbf/linear-technology
IC5 = DW01A-G: Integrated Circuit; Manufacturer_Name: Fortune Semiconductor Corporation; Datasheet Link: http://acoptex.com/uploads/DW01A.pdf; Height: 1.35mm; Manufacturer_Part_Number: DW01A-G
IC6 = ST1S32PUR: Integrated Circuit; Manufacturer_Name: STMicroelectronics; Datasheet Link: http://www.st.com/web/en/resource/technical/document/datasheet/DM00056321.pdf; Height: 1mm; Manufacturer_Part_Number: ST1S32PUR; Mouser Part Number: 511-ST1S32PUR; Mouser Price/Stock: https://www.mouser.co.uk/ProductDetail/STMicroelectronics/ST1S32PUR?qs=gNDSiZmRJS9JfBN%2Fr%252BmKGQ%3D%3D; Arrow Part Number: ST1S32PUR; Arrow Price/Stock: https://www.arrow.com/en/products/st1s32pur/stmicroelectronics?region=europe
IC7 = TPS2500DRCT: Integrated Circuit; Manufacturer_Name: Texas Instruments; Datasheet Link: http://www.ti.com/lit/gpn/TPS2500; Manufacturer_Part_Number: TPS2500DRCT; Mouser Part Number: 595-TPS2500DRCT; Mouser Price/Stock: https://www.mouser.co.uk/ProductDetail/Texas-Instruments/TPS2500DRCT?qs=IK5e5L0zOXg4%252Be3iAH4kIA%3D%3D; Arrow Part Number: TPS2500DRCT; Arrow Price/Stock: https://www.arrow.com/en/products/tps2500drct/texas-instruments
J7 = 1-1123723-2: as J13 on sheet DC_DC_ISO; EU_RoHS_Compliance: Compliant; Value: *; TE_purchase_URL: https://www.te.com/usa-en/product-1-1123723-2.html?te_bu=Cor&te_type=disp&te_campaign=seda_glo_cor-seda-global-disp-prtnr-fy19-seda-model-bom-cta_sma-317_1&elqCampaignId=32493; SnapEDA_Link: https://www.snapeda.com/parts/1-1123723-2/TE%20Connectivity%20AMP%20Connectors/view-part/231687/?ref=snap; Package: None; MP: 1-1123723-2; Digi-Key_Purchase_URL: https://www.digikey.com/product-detail/en/te-connectivity-amp-connectors/1-1123723-2/A111830-ND/686925?utm_source=snapeda&utm_medium=aggregator&utm_campaign=symbol; Digi-Key_Part_Number: A111830-ND
J8 J9 = CON_HDR1x2: ComponentLink1URL: https://www.jst-mfg.com/product/pdf/eng/eXH.pdf; ComponentLink1Description: Datasheet
L2 L3 = 7447798720: Fixed Ind 7.2UH 7.9A 12.8 Mohm; Manufacturer: Wurth Electronics; Core Material: Metal,Composite; Saturation Current: 6A; Tolerance: 30%; Shielding: Shielded; Self Resonant Frequency: 31MHz; DC Resistance (DCR): 12.8mR; Test Frequency: 100kHz; Max DC Current: 6.5A; Supplier 1: Newark; Manufacturer Part Number: 7447798720; RoHS: Yes; Category: Fixed Inductors; Stock 1: 203; Pricing 1: 1=3.34000, 10=3.09000, 25=3.05000, 50=3.02000, 100=2.98000, 250=2.65000 (USD); Mount: Surface Mount; Case/Package: Nonstandard; Min Operating Temperature: -40°C; Max Operating Temperature: 150°C; Package Quantity: 1; Current Rating: 7.9A; Packaging: Tape and Reel; Inductance Tolerance: 30%; Resistor Type: Wirewound; Inductance: 7.2uH; Termination: SMD/SMT; RMS Current (Irms): 7.9A; Series: WE-PDF; Length: 0.402inch; Width: 0.402inch; Height: 6.4mm; Height - Seated (Max): 0.252inch; REACH SVHC: Unknown; RoHS Compliant: Yes; ComponentLink1URL: https://datasheet.ciiva.com/7892/1736564-7892967.pdf?src-supplier=Element14; ComponentLink1Description: https://datasheet.ciiva.com/7892/1736564-7892967.pdf?src-supplier=Element14; ComponentLink2URL: https://datasheet.ciiva.com/6171/530544-6171082.pdf?src-supplier=Farnell; ComponentLink2Description: https://datasheet.ciiva.com/6171/530544-6171082.pdf?src-supplier=Farnell; ComponentLink3URL: https://datasheet.ciiva.com/4954/7447798720-38957-4954724.pdf?src-supplier=Mouser; ComponentLink3Description: https://datasheet.ciiva.com/4954/7447798720-38957-4954724.pdf?src-supplier=Mouser; ComponentLink4URL: https://datasheet.ciiva.com/1060/7447798720-1060960.pdf?src-supplier=Digi-Key; ComponentLink4Description: https://datasheet.ciiva.com/1060/7447798720-1060960.pdf?src-supplier=Digi-Key; ComponentLink5URL: https://datasheet.ciiva.com/1060/7447798720-1060961.pdf?src-supplier=Digi-Key; ComponentLink5Description: https://datasheet.ciiva.com/1060/7447798720-1060961.pdf?src-supplier=Digi-Key; ComponentLink6URL: https://datasheet.ciiva.com/1060/7447798720-1060962.pdf?src-supplier=Digi-Key; ComponentLink6Description: https://datasheet.ciiva.com/1060/7447798720-1060962.pdf?src-supplier=Digi-Key; Supplier Part Number 1: 78R5736
L5 = IND/VLC5045
Q1 = SQ4005EY: MOSFET P Ch -12Vds 8Vgs
Q2 Q3 = FS8205A: Transistor; Manufacturer_Name: SII Semiconductor; Datasheet Link: http://www.ic-fortune.com/upload/Download/FS8205A-DS-12_EN.pdf; Height: 1.2mm; Manufacturer_Part_Number: FS8205A
R28-R44 = Res
TP1-TP4 = Test Pad
U4 U5 = MT3608L: High Efficiency 1.2MHz2A Step Up Converter; MF: Aerosemi Technology Co., Ltd; MP: MT3608; Package: Package Analog Devices; Availability: Unavailable; Value: *; SnapEDA_Link: https://www.snapeda.com/parts/MT3608/Aerosemi%20Technology%20Co.%2C%20Ltd/view-part/3218014/?ref=snap; Price: None

## Sheet TRANSFORMER_RJ45.SchDoc
size 386 x 246 mm
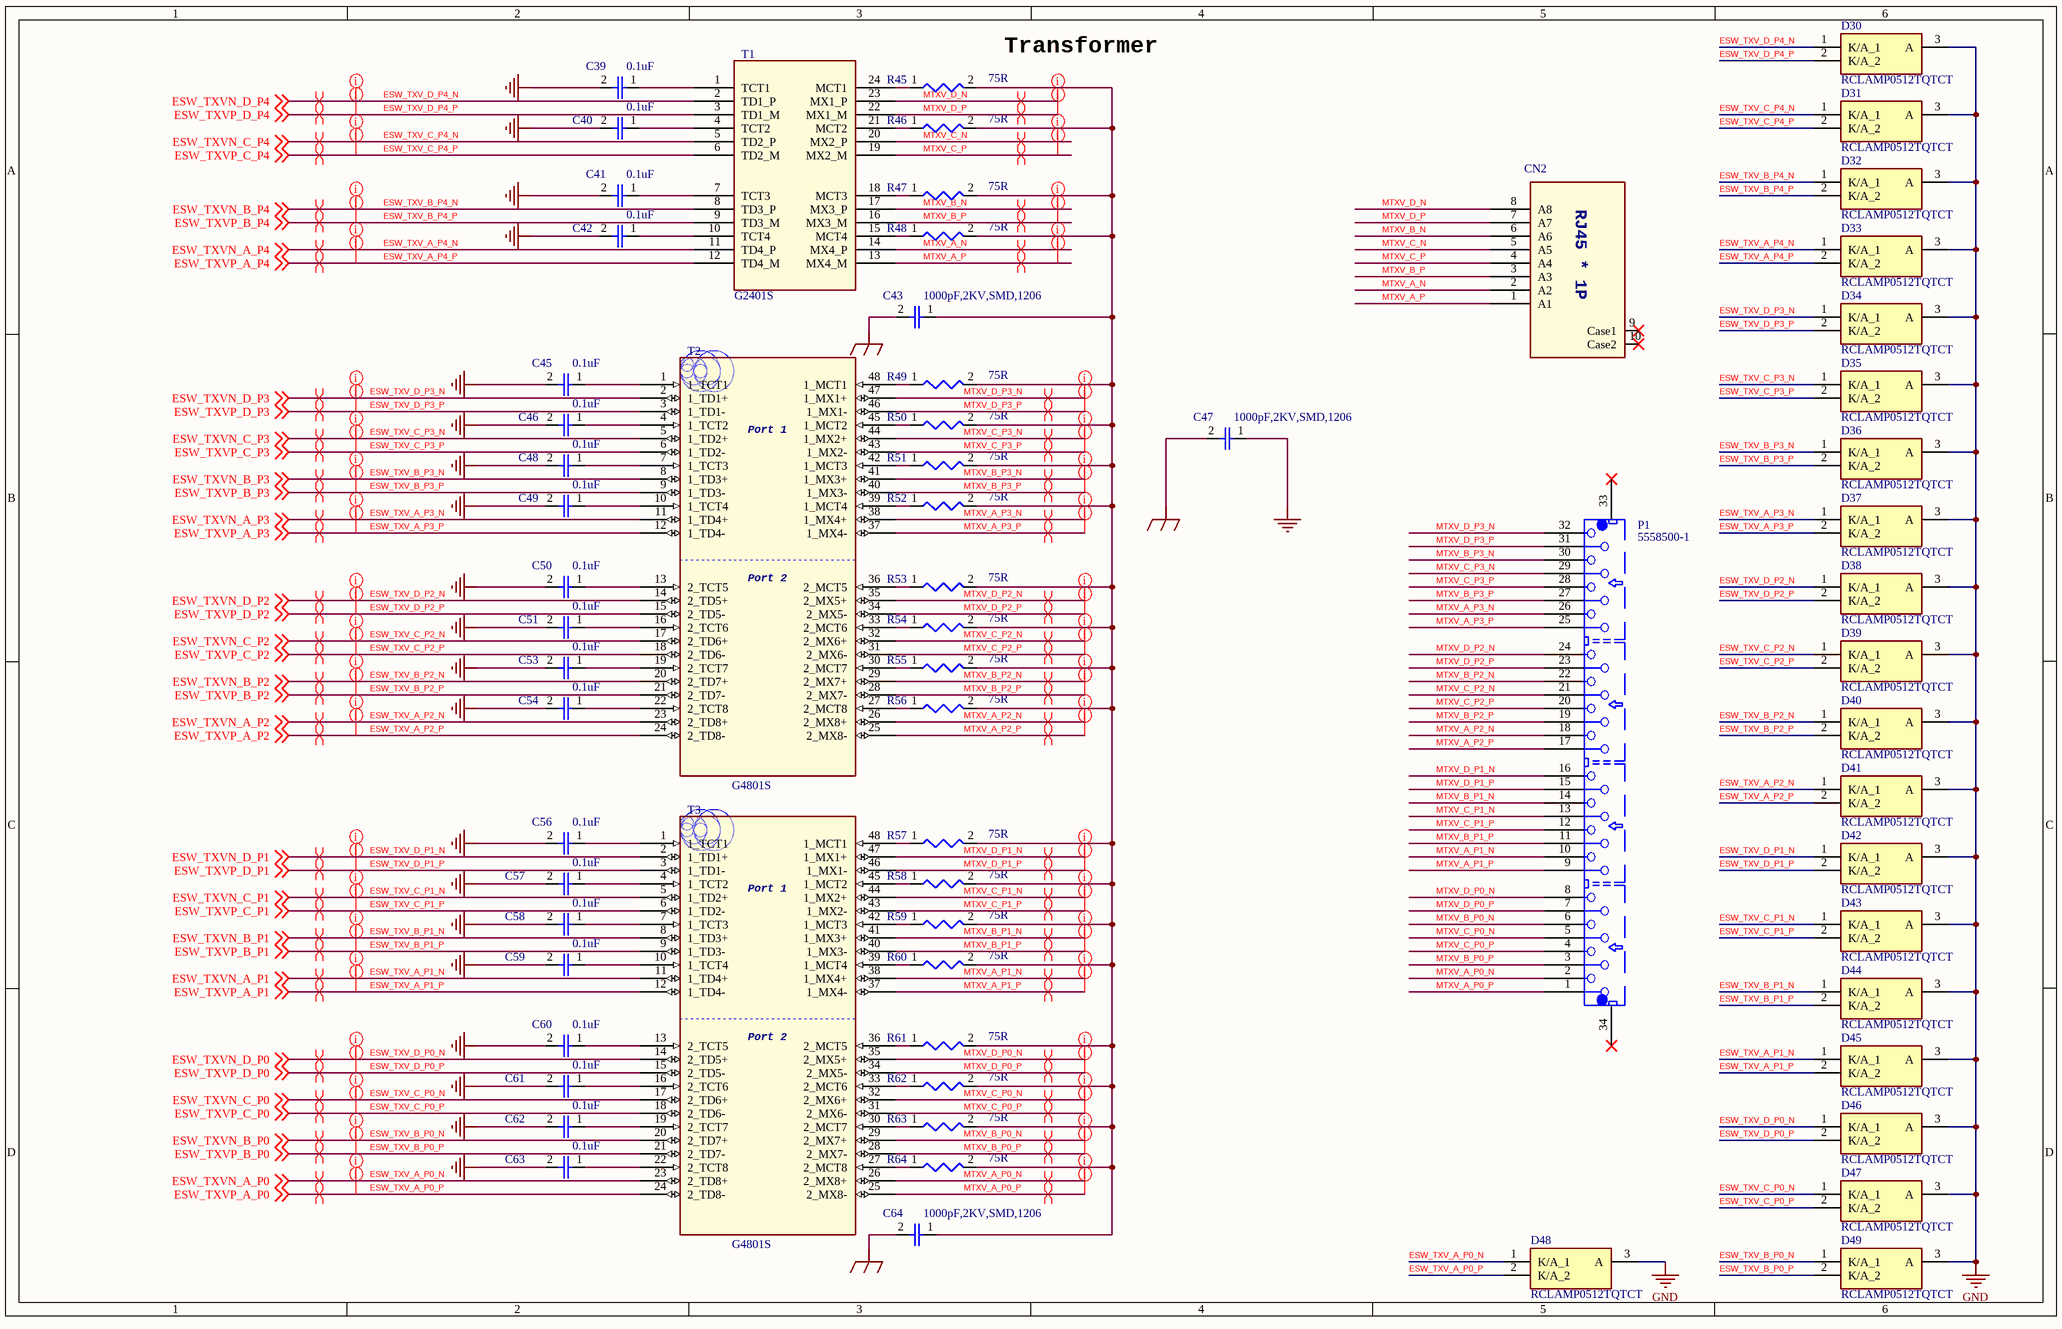
[diagram p3: TRANSFORMER_RJ45.SchDoc]

### Parts
C39  0.1uF  [0402-C]
C40  0.1uF  [0402-C]
C41  0.1uF  [0402-C]
C42  0.1uF  [0402-C]
C43  1000pF,2KV,SMD,1206  [1206-C]
C45  0.1uF  [0402-C]
C46  0.1uF  [0402-C]
C47  1000pF,2KV,SMD,1206  [1206-C]
C48  0.1uF  [0402-C]
C49  0.1uF  [0402-C]
C50  0.1uF  [0402-C]
C51  0.1uF  [0402-C]
C53  0.1uF  [0402-C]
C54  0.1uF  [0402-C]
C56  0.1uF  [0402-C]
C57  0.1uF  [0402-C]
C58  0.1uF  [0402-C]
C59  0.1uF  [0402-C]
C60  0.1uF  [0402-C]
C61  0.1uF  [0402-C]
C62  0.1uF  [0402-C]
C63  0.1uF  [0402-C]
C64  1000pF,2KV,SMD,1206  [1206-C]
CN2  6116518-1  [BEL_SS-6488-NF]  (value not drawn)
D30  RCLAMP0512TQTCT  [RCLAMP0512TQTCT]
D31  RCLAMP0512TQTCT  [RCLAMP0512TQTCT]
D32  RCLAMP0512TQTCT  [RCLAMP0512TQTCT]
D33  RCLAMP0512TQTCT  [RCLAMP0512TQTCT]
D34  RCLAMP0512TQTCT  [RCLAMP0512TQTCT]
D35  RCLAMP0512TQTCT  [RCLAMP0512TQTCT]
D36  RCLAMP0512TQTCT  [RCLAMP0512TQTCT]
D37  RCLAMP0512TQTCT  [RCLAMP0512TQTCT]
D38  RCLAMP0512TQTCT  [RCLAMP0512TQTCT]
D39  RCLAMP0512TQTCT  [RCLAMP0512TQTCT]
D40  RCLAMP0512TQTCT  [RCLAMP0512TQTCT]
D41  RCLAMP0512TQTCT  [RCLAMP0512TQTCT]
D42  RCLAMP0512TQTCT  [RCLAMP0512TQTCT]
D43  RCLAMP0512TQTCT  [RCLAMP0512TQTCT]
D44  RCLAMP0512TQTCT  [RCLAMP0512TQTCT]
D45  RCLAMP0512TQTCT  [RCLAMP0512TQTCT]
D46  RCLAMP0512TQTCT  [RCLAMP0512TQTCT]
D47  RCLAMP0512TQTCT  [RCLAMP0512TQTCT]
D48  RCLAMP0512TQTCT  [RCLAMP0512TQTCT]
D49  RCLAMP0512TQTCT  [RCLAMP0512TQTCT]
P1  5558500-1  [CONN_ARJ14A-MESA-MU2]
R45  75R  [0402-R]
R46  75R  [0402-R]
R47  75R  [0402-R]
R48  75R  [0402-R]
R49  75R  [0402-R]
R50  75R  [0402-R]
R51  75R  [0402-R]
R52  75R  [0402-R]
R53  75R  [0402-R]
R54  75R  [0402-R]
R55  75R  [0402-R]
R56  75R  [0402-R]
R57  75R  [0402-R]
R58  75R  [0402-R]
R59  75R  [0402-R]
R60  75R  [0402-R]
R61  75R  [0402-R]
R62  75R  [0402-R]
R63  75R  [0402-R]
R64  75R  [0402-R]
T1  G2401S  [SOP127P1600X572-24N]
T2  G4801S  [NV6]
T3  G4801S  [NV6]

### Nets
CHGND_GE_A: C43.2 C47.2 C64.2
GND: C39.2 C40.2 C41.2 C42.2 C45.2 C46.2 C47.1 C48.2 C49.2 C50.2 C51.2 C53.2 C54.2 C56.2 C57.2 C58.2 C59.2 C60.2 C61.2 C62.2 C63.2 D30.3(A) D31.3(A) D32.3(A) D33.3(A) D34.3(A) D35.3(A) D36.3(A) D37.3(A) D38.3(A) D39.3(A) D40.3(A) D41.3(A) D42.3(A) D43.3(A) D44.3(A) D45.3(A) D46.3(A) D47.3(A) D48.3(A) D49.3(A)
ESW_TXV_A_P0_N: D48.1(K/A_1) T3.23(2_TD8+) ; off-sheet ESW_TXVN_A_P0  [also labelled ESW_TXVN_A_P0]
ESW_TXV_A_P0_P: D48.2(K/A_2) T3.24(2_TD8-) ; off-sheet ESW_TXVP_A_P0  [also labelled ESW_TXVP_A_P0]
ESW_TXV_A_P1_N: D45.1(K/A_1) T3.11(1_TD4+) ; off-sheet ESW_TXVN_A_P1  [also labelled ESW_TXVN_A_P1]
ESW_TXV_A_P1_P: D45.2(K/A_2) T3.12(1_TD4-) ; off-sheet ESW_TXVP_A_P1  [also labelled ESW_TXVP_A_P1]
ESW_TXV_A_P2_N: D41.1(K/A_1) T2.23(2_TD8+) ; off-sheet ESW_TXVN_A_P2  [also labelled ESW_TXVN_A_P2]
ESW_TXV_A_P2_P: D41.2(K/A_2) T2.24(2_TD8-) ; off-sheet ESW_TXVP_A_P2  [also labelled ESW_TXVP_A_P2]
ESW_TXV_A_P3_N: D37.1(K/A_1) T2.11(1_TD4+) ; off-sheet ESW_TXVN_A_P3  [also labelled ESW_TXVN_A_P3]
ESW_TXV_A_P3_P: D37.2(K/A_2) T2.12(1_TD4-) ; off-sheet ESW_TXVP_A_P3  [also labelled ESW_TXVP_A_P3]
ESW_TXV_A_P4_N: D33.1(K/A_1) T1.11(TD4_P) ; off-sheet ESW_TXVN_A_P4  [also labelled ESW_TXVN_A_P4]
ESW_TXV_A_P4_P: D33.2(K/A_2) T1.12(TD4_M) ; off-sheet ESW_TXVP_A_P4  [also labelled ESW_TXVP_A_P4]
ESW_TXV_B_P0_N: D49.1(K/A_1) T3.20(2_TD7+) ; off-sheet ESW_TXVN_B_P0  [also labelled ESW_TXVN_B_P0]
ESW_TXV_B_P0_P: D49.2(K/A_2) T3.21(2_TD7-) ; off-sheet ESW_TXVP_B_P0  [also labelled ESW_TXVP_B_P0]
ESW_TXV_B_P1_N: D44.1(K/A_1) T3.8(1_TD3+) ; off-sheet ESW_TXVN_B_P1  [also labelled ESW_TXVN_B_P1]
ESW_TXV_B_P1_P: D44.2(K/A_2) T3.9(1_TD3-) ; off-sheet ESW_TXVP_B_P1  [also labelled ESW_TXVP_B_P1]
ESW_TXV_B_P2_N: D40.1(K/A_1) T2.20(2_TD7+) ; off-sheet ESW_TXVN_B_P2  [also labelled ESW_TXVN_B_P2]
ESW_TXV_B_P2_P: D40.2(K/A_2) T2.21(2_TD7-) ; off-sheet ESW_TXVP_B_P2  [also labelled ESW_TXVP_B_P2]
ESW_TXV_B_P3_N: D36.1(K/A_1) T2.8(1_TD3+) ; off-sheet ESW_TXVN_B_P3  [also labelled ESW_TXVN_B_P3]
ESW_TXV_B_P3_P: D36.2(K/A_2) T2.9(1_TD3-) ; off-sheet ESW_TXVP_B_P3  [also labelled ESW_TXVP_B_P3]
ESW_TXV_B_P4_N: D32.1(K/A_1) T1.8(TD3_P) ; off-sheet ESW_TXVN_B_P4  [also labelled ESW_TXVN_B_P4]
ESW_TXV_B_P4_P: D32.2(K/A_2) T1.9(TD3_M) ; off-sheet ESW_TXVP_B_P4  [also labelled ESW_TXVP_B_P4]
ESW_TXV_C_P0_N: D47.1(K/A_1) T3.17(2_TD6+) ; off-sheet ESW_TXVN_C_P0  [also labelled ESW_TXVN_C_P0]
ESW_TXV_C_P0_P: D47.2(K/A_2) T3.18(2_TD6-) ; off-sheet ESW_TXVP_C_P0  [also labelled ESW_TXVP_C_P0]
ESW_TXV_C_P1_N: D43.1(K/A_1) T3.5(1_TD2+) ; off-sheet ESW_TXVN_C_P1  [also labelled ESW_TXVN_C_P1]
ESW_TXV_C_P1_P: D43.2(K/A_2) T3.6(1_TD2-) ; off-sheet ESW_TXVP_C_P1  [also labelled ESW_TXVP_C_P1]
ESW_TXV_C_P2_N: D39.1(K/A_1) T2.17(2_TD6+) ; off-sheet ESW_TXVN_C_P2  [also labelled ESW_TXVN_C_P2]
ESW_TXV_C_P2_P: D39.2(K/A_2) T2.18(2_TD6-) ; off-sheet ESW_TXVP_C_P2  [also labelled ESW_TXVP_C_P2]
ESW_TXV_C_P3_N: D35.1(K/A_1) T2.5(1_TD2+) ; off-sheet ESW_TXVN_C_P3  [also labelled ESW_TXVN_C_P3]
ESW_TXV_C_P3_P: D35.2(K/A_2) T2.6(1_TD2-) ; off-sheet ESW_TXVP_C_P3  [also labelled ESW_TXVP_C_P3]
ESW_TXV_C_P4_N: D31.1(K/A_1) T1.5(TD2_P) ; off-sheet ESW_TXVN_C_P4  [also labelled ESW_TXVN_C_P4]
ESW_TXV_C_P4_P: D31.2(K/A_2) T1.6(TD2_M) ; off-sheet ESW_TXVP_C_P4  [also labelled ESW_TXVP_C_P4]
ESW_TXV_D_P0_N: D46.1(K/A_1) T3.14(2_TD5+) ; off-sheet ESW_TXVN_D_P0  [also labelled ESW_TXVN_D_P0]
ESW_TXV_D_P0_P: D46.2(K/A_2) T3.15(2_TD5-) ; off-sheet ESW_TXVP_D_P0  [also labelled ESW_TXVP_D_P0]
ESW_TXV_D_P1_N: D42.1(K/A_1) T3.2(1_TD1+) ; off-sheet ESW_TXVN_D_P1  [also labelled ESW_TXVN_D_P1]
ESW_TXV_D_P1_P: D42.2(K/A_2) T3.3(1_TD1-) ; off-sheet ESW_TXVP_D_P1  [also labelled ESW_TXVP_D_P1]
ESW_TXV_D_P2_N: D38.1(K/A_1) T2.14(2_TD5+) ; off-sheet ESW_TXVN_D_P2  [also labelled ESW_TXVN_D_P2]
ESW_TXV_D_P2_P: D38.2(K/A_2) T2.15(2_TD5-) ; off-sheet ESW_TXVP_D_P2  [also labelled ESW_TXVP_D_P2]
ESW_TXV_D_P3_N: D34.1(K/A_1) T2.2(1_TD1+) ; off-sheet ESW_TXVN_D_P3  [also labelled ESW_TXVN_D_P3]
ESW_TXV_D_P3_P: D34.2(K/A_2) T2.3(1_TD1-) ; off-sheet ESW_TXVP_D_P3  [also labelled ESW_TXVP_D_P3]
ESW_TXV_D_P4_N: D30.1(K/A_1) T1.2(TD1_P) ; off-sheet ESW_TXVN_D_P4  [also labelled ESW_TXVN_D_P4]
ESW_TXV_D_P4_P: D30.2(K/A_2) T1.3(TD1_M) ; off-sheet ESW_TXVP_D_P4  [also labelled ESW_TXVP_D_P4]
MTXV_A_N: CN2.2(A2) T1.14(MX4_P)
MTXV_A_P: CN2.1(A1) T1.13(MX4_M)
MTXV_A_P0_N: P1.2 T3.26(2_MX8+)
MTXV_A_P0_P: P1.1 T3.25(2_MX8-)
MTXV_A_P1_N: P1.10 T3.38(1_MX4+)
MTXV_A_P1_P: P1.9 T3.37(1_MX4-)
MTXV_A_P2_N: P1.18 T2.26(2_MX8+)
MTXV_A_P2_P: P1.17 T2.25(2_MX8-)
MTXV_A_P3_N: P1.26 T2.38(1_MX4+)
MTXV_A_P3_P: P1.25 T2.37(1_MX4-)
MTXV_B_N: CN2.6(A6) T1.17(MX3_P)
MTXV_B_P: CN2.3(A3) T1.16(MX3_M)
MTXV_B_P0_N: P1.6 T3.29(2_MX7+)
MTXV_B_P0_P: P1.3 T3.28(2_MX7-)
MTXV_B_P1_N: P1.14 T3.41(1_MX3+)
MTXV_B_P1_P: P1.11 T3.40(1_MX3-)
MTXV_B_P2_N: P1.22 T2.29(2_MX7+)
MTXV_B_P2_P: P1.19 T2.28(2_MX7-)
MTXV_B_P3_N: P1.30 T2.41(1_MX3+)
MTXV_B_P3_P: P1.27 T2.40(1_MX3-)
MTXV_C_N: CN2.5(A5) T1.20(MX2_P)
MTXV_C_P: CN2.4(A4) T1.19(MX2_M)
MTXV_C_P0_N: P1.5 T3.32(2_MX6+)
MTXV_C_P0_P: P1.4 T3.31(2_MX6-)
MTXV_C_P1_N: P1.13 T3.44(1_MX2+)
MTXV_C_P1_P: P1.12 T3.43(1_MX2-)
MTXV_C_P2_N: P1.21 T2.32(2_MX6+)
MTXV_C_P2_P: P1.20 T2.31(2_MX6-)
MTXV_C_P3_N: P1.29 T2.44(1_MX2+)
MTXV_C_P3_P: P1.28 T2.43(1_MX2-)
MTXV_D_N: CN2.8(A8) T1.23(MX1_P)
MTXV_D_P: CN2.7(A7) T1.22(MX1_M)
MTXV_D_P0_N: P1.8 T3.35(2_MX5+)
MTXV_D_P0_P: P1.7 T3.34(2_MX5-)
MTXV_D_P1_N: P1.16 T3.47(1_MX1+)
MTXV_D_P1_P: P1.15 T3.46(1_MX1-)
MTXV_D_P2_N: P1.24 T2.35(2_MX5+)
MTXV_D_P2_P: P1.23 T2.34(2_MX5-)
MTXV_D_P3_N: P1.32 T2.47(1_MX1+)
MTXV_D_P3_P: P1.31 T2.46(1_MX1-)
NetC39_1: C39.1 T1.1(TCT1)
NetC40_1: C40.1 T1.4(TCT2)
NetC41_1: C41.1 T1.7(TCT3)
NetC42_1: C42.1 T1.10(TCT4)
NetC43_1: C43.1 C64.1 R45.2 R46.2 R47.2 R48.2 R49.2 R50.2 R51.2 R52.2 R53.2 R54.2 R55.2 R56.2 R57.2 R58.2 R59.2 R60.2 R61.2 R62.2 R63.2 R64.2
NetC45_1: C45.1 T2.1(1_TCT1)
NetC46_1: C46.1 T2.4(1_TCT2)
NetC48_1: C48.1 T2.7(1_TCT3)
NetC49_1: C49.1 T2.10(1_TCT4)
NetC50_1: C50.1 T2.13(2_TCT5)
NetC51_1: C51.1 T2.16(2_TCT6)
NetC53_1: C53.1 T2.19(2_TCT7)
NetC54_1: C54.1 T2.22(2_TCT8)
NetC56_1: C56.1 T3.1(1_TCT1)
NetC57_1: C57.1 T3.4(1_TCT2)
NetC58_1: C58.1 T3.7(1_TCT3)
NetC59_1: C59.1 T3.10(1_TCT4)
NetC60_1: C60.1 T3.13(2_TCT5)
NetC61_1: C61.1 T3.16(2_TCT6)
NetC62_1: C62.1 T3.19(2_TCT7)
NetC63_1: C63.1 T3.22(2_TCT8)
NetR45_1: R45.1 T1.24(MCT1)
NetR46_1: R46.1 T1.21(MCT2)
NetR47_1: R47.1 T1.18(MCT3)
NetR48_1: R48.1 T1.15(MCT4)
NetR49_1: R49.1 T2.48(1_MCT1)
NetR50_1: R50.1 T2.45(1_MCT2)
NetR51_1: R51.1 T2.42(1_MCT3)
NetR52_1: R52.1 T2.39(1_MCT4)
NetR53_1: R53.1 T2.36(2_MCT5)
NetR54_1: R54.1 T2.33(2_MCT6)
NetR55_1: R55.1 T2.30(2_MCT7)
NetR56_1: R56.1 T2.27(2_MCT8)
NetR57_1: R57.1 T3.48(1_MCT1)
NetR58_1: R58.1 T3.45(1_MCT2)
NetR59_1: R59.1 T3.42(1_MCT3)
NetR60_1: R60.1 T3.39(1_MCT4)
NetR61_1: R61.1 T3.36(2_MCT5)
NetR62_1: R62.1 T3.33(2_MCT6)
NetR63_1: R63.1 T3.30(2_MCT7)
NetR64_1: R64.1 T3.27(2_MCT8)

Not connected (* = marked no-connect by the designer): CN2 9(Case1)* 10(Case2)*; P1 33* 34*

### Layout directives
differential pair; differential pair class DIFF100: ESW_TXV_A_P0_N, ESW_TXV_A_P0_P, ESW_TXV_A_P1_N, ESW_TXV_A_P1_P, ESW_TXV_A_P2_N, ESW_TXV_A_P2_P, ESW_TXV_A_P3_N, ESW_TXV_A_P3_P, ESW_TXV_A_P4_N, ESW_TXV_A_P4_P, ESW_TXV_B_P0_N, ESW_TXV_B_P0_P, ESW_TXV_B_P1_N, ESW_TXV_B_P1_P, ESW_TXV_B_P2_N, ESW_TXV_B_P2_P, ESW_TXV_B_P3_N, ESW_TXV_B_P3_P, ESW_TXV_B_P4_N, ESW_TXV_B_P4_P, ESW_TXV_C_P0_N, ESW_TXV_C_P0_P, ESW_TXV_C_P1_N, ESW_TXV_C_P1_P, ESW_TXV_C_P2_N, ESW_TXV_C_P2_P, ESW_TXV_C_P3_N, ESW_TXV_C_P3_P, ESW_TXV_C_P4_N, ESW_TXV_C_P4_P, ESW_TXV_D_P0_N, ESW_TXV_D_P0_P, ESW_TXV_D_P1_N, ESW_TXV_D_P1_P, ESW_TXV_D_P2_N, ESW_TXV_D_P2_P, ESW_TXV_D_P3_N, ESW_TXV_D_P3_P, ESW_TXV_D_P4_N, ESW_TXV_D_P4_P, MTXV_A_N, MTXV_A_P, MTXV_A_P0_N, MTXV_A_P0_P, MTXV_A_P1_N, MTXV_A_P1_P, MTXV_A_P2_N, MTXV_A_P2_P, MTXV_A_P3_N, MTXV_A_P3_P, MTXV_B_N, MTXV_B_P, MTXV_B_P0_N, MTXV_B_P0_P, MTXV_B_P1_N, MTXV_B_P1_P, MTXV_B_P2_N, MTXV_B_P2_P, MTXV_B_P3_N, MTXV_B_P3_P, MTXV_C_N, MTXV_C_P, MTXV_C_P0_N, MTXV_C_P0_P, MTXV_C_P1_N, MTXV_C_P1_P, MTXV_C_P2_N, MTXV_C_P2_P, MTXV_C_P3_N, MTXV_C_P3_P, MTXV_D_N, MTXV_D_P, MTXV_D_P0_N, MTXV_D_P0_P, MTXV_D_P1_N, MTXV_D_P1_P, MTXV_D_P2_N, MTXV_D_P2_P, MTXV_D_P3_N, MTXV_D_P3_P
rule Matched Net Lengths [Tolerance = 100mil]: ESW_TXV_A_P0_N, ESW_TXV_A_P0_P, ESW_TXV_A_P1_N, ESW_TXV_A_P1_P, ESW_TXV_A_P2_N, ESW_TXV_A_P2_P, ESW_TXV_A_P3_N, ESW_TXV_A_P3_P, ESW_TXV_A_P4_N, ESW_TXV_A_P4_P, ESW_TXV_B_P0_N, ESW_TXV_B_P0_P, ESW_TXV_B_P1_N, ESW_TXV_B_P1_P, ESW_TXV_B_P2_N, ESW_TXV_B_P2_P, ESW_TXV_B_P3_N, ESW_TXV_B_P3_P, ESW_TXV_B_P4_N, ESW_TXV_B_P4_P, ESW_TXV_C_P0_N, ESW_TXV_C_P0_P, ESW_TXV_C_P1_N, ESW_TXV_C_P1_P, ESW_TXV_C_P2_N, ESW_TXV_C_P2_P, ESW_TXV_C_P3_N, ESW_TXV_C_P3_P, ESW_TXV_C_P4_N, ESW_TXV_C_P4_P, ESW_TXV_D_P0_N, ESW_TXV_D_P0_P, ESW_TXV_D_P1_N, ESW_TXV_D_P1_P, ESW_TXV_D_P2_N, ESW_TXV_D_P2_P, ESW_TXV_D_P3_N, ESW_TXV_D_P3_P, ESW_TXV_D_P4_N, ESW_TXV_D_P4_P, MTXV_A_N, MTXV_A_P, MTXV_A_P0_N, MTXV_A_P0_P, MTXV_A_P1_N, MTXV_A_P1_P, MTXV_A_P2_N, MTXV_A_P2_P, MTXV_A_P3_N, MTXV_A_P3_P, MTXV_B_N, MTXV_B_P, MTXV_B_P0_N, MTXV_B_P0_P, MTXV_B_P1_N, MTXV_B_P1_P, MTXV_B_P2_N, MTXV_B_P2_P, MTXV_B_P3_N, MTXV_B_P3_P, MTXV_C_N, MTXV_C_P, MTXV_C_P0_N, MTXV_C_P0_P, MTXV_C_P1_N, MTXV_C_P1_P, MTXV_C_P2_N, MTXV_C_P2_P, MTXV_C_P3_N, MTXV_C_P3_P, MTXV_D_N, MTXV_D_P, MTXV_D_P0_N, MTXV_D_P0_P, MTXV_D_P1_N, MTXV_D_P1_P, MTXV_D_P2_N, MTXV_D_P2_P, MTXV_D_P3_N, MTXV_D_P3_P

### Notes on the sheet
- (near R45) Transformer
- (in symbol 6116518-1) RJ45 * 1P
- (in symbol G4801S) Port 1; Port 2

### Library data of the parts
C39-C43 C45-C51 C53 C54 C56-C64 = CAP
D30-D49 = RCLAMP0512TQTCT: Diode; Manufacturer_Name: SEMTECH; Datasheet Link: https://media.digikey.com/pdf/Data%20Sheets/Semtech%20PDFs/RCLAMP0512TQ_Rev6_12-17-15.pdf; Height: 0.45mm; Manufacturer_Part_Number: RCLAMP0512TQTCT; Mouser Part Number: 947-RCLAMP0512TQTCT; Mouser Price/Stock: https://www.mouser.co.uk/ProductDetail/Semtech/RCLAMP0512TQTCT?qs=rBWM4%252BvDhIfq7vcNOg1BvQ%3D%3D; Arrow Part Number: RCLAMP0512TQTCT; Arrow Price/Stock: https://www.arrow.com/en/products/rclamp0512tqtct/semtech?region=europe
R45-R64 = Res
T1 = G2401S: Audio Transformers / Signal Transformers 1000BaseT SMD NonPoE 350uH .65Ohms 1-Por
T2 T3 = G4801S: Audio Transformers / Signal Transformers GIGABIT ISO MOD SMD 48P 2-Port w/Choke

## Sheet USB3.0_Console.SchDoc
size A4
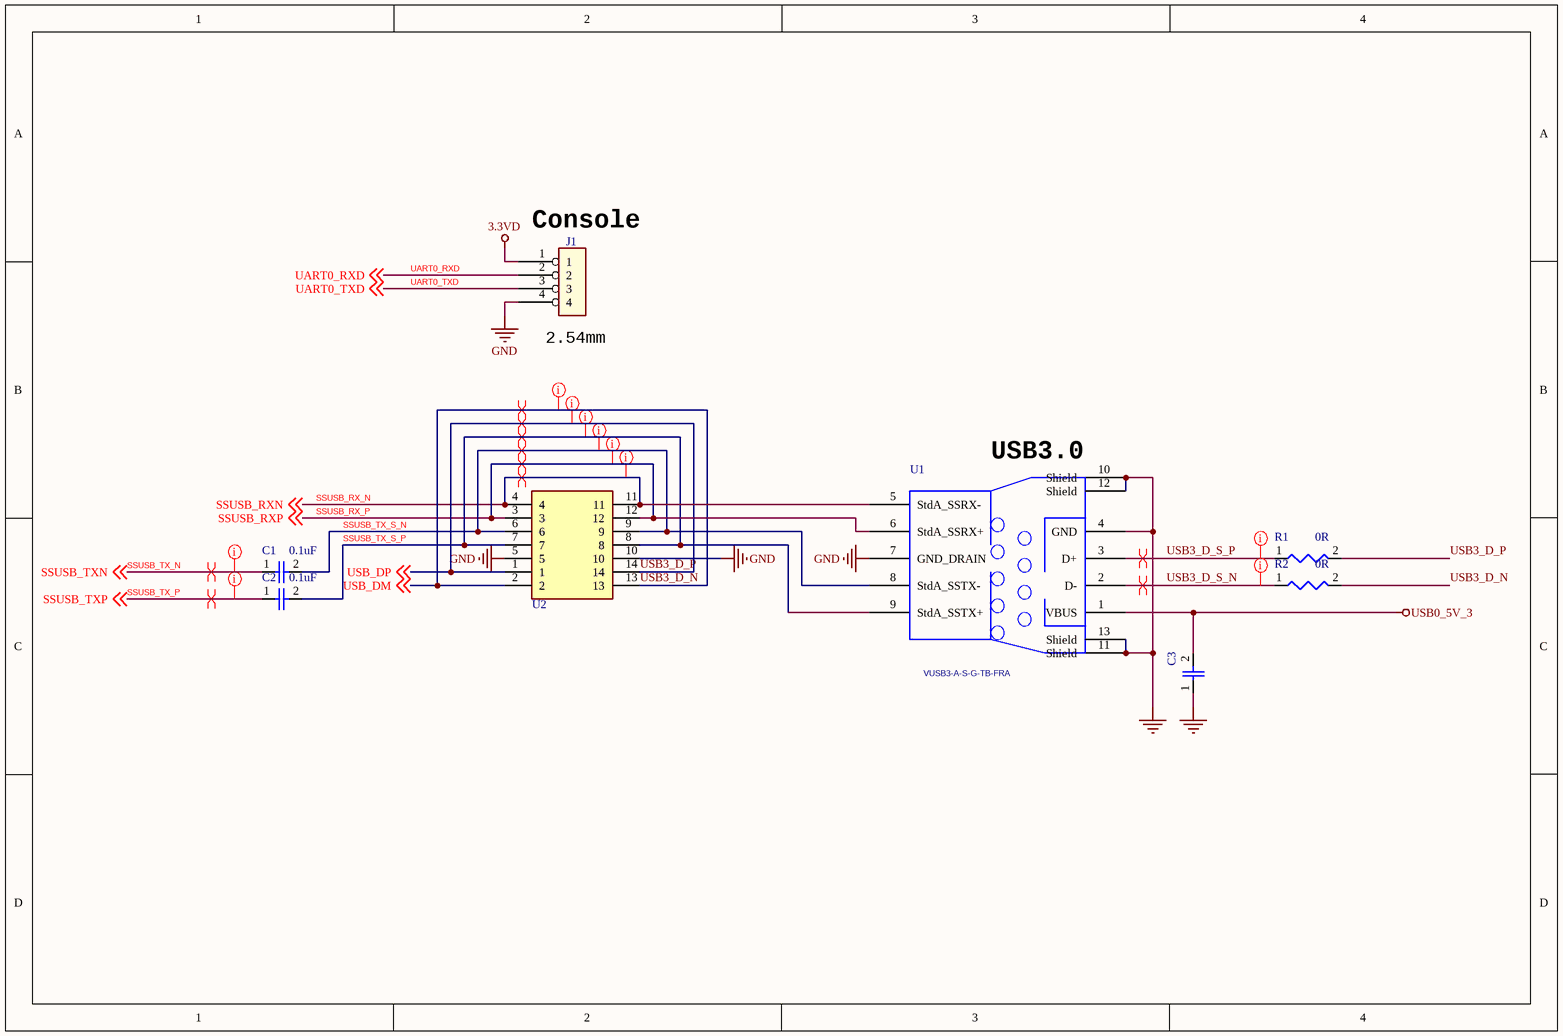
[diagram p4: USB3.0_Console.SchDoc]

### Parts
C1  0.1uF  [0402-C]
C2  0.1uF  [0402-C]
C3  22uF,10V,0805  [0805-C]  (value not drawn)
J1  HEADER 4x1  [CONN_4X1]  (value not drawn)
R1  0R  [0402-R]
R2  0R  [0402-R]
U1  VUSB3-A-S-G-TB-FRA  [VALCON_VUSB3-A-S-G-TB-FRA]
U2  SP3011-06UTG  [SON50P350X135X55-14N]  (value not drawn)

### Nets
3.3VD: J1.1
GND: C3.1 J1.4 U1.4(GND) U1.7(GND_DRAIN) U1.10(Shield) U1.11(Shield) U1.12(Shield) U1.13(Shield) U2.5 U2.10
USB0_5V_3: C3.2 U1.1(VBUS)
SSUSB_RX_N: U1.5(StdA_SSRX-) U2.4 U2.11 ; off-sheet SSUSB_RXN  [also labelled SSUSB_RXN]
SSUSB_RX_P: U1.6(StdA_SSRX+) U2.3 U2.12 ; off-sheet SSUSB_RXP  [also labelled SSUSB_RXP]
SSUSB_TX_N: C1.1 ; off-sheet SSUSB_TXN  [also labelled SSUSB_TXN]
SSUSB_TX_P: C2.1 ; off-sheet SSUSB_TXP  [also labelled SSUSB_TXP]
SSUSB_TX_S_N: C1.2 U1.8(StdA_SSTX-) U2.6 U2.9
SSUSB_TX_S_P: C2.2 U1.9(StdA_SSTX+) U2.7 U2.8
UART0_RXD: J1.2 ; off-sheet UART0_RXD
UART0_TXD: J1.3 ; off-sheet UART0_TXD
USB3_D_N: R2.2 U2.2 U2.13 ; off-sheet USB_DM  [also labelled USB_DM]
USB3_D_P: R1.2 U2.1 U2.14 ; off-sheet USB_DP  [also labelled USB_DP]
USB3_D_S_N: R2.1 U1.2(D-)
USB3_D_S_P: R1.1 U1.3(D+)

### Layout directives
differential pair; differential pair class DIFF90: SSUSB_RX_N, SSUSB_RX_P, SSUSB_TX_N, SSUSB_TX_P, SSUSB_TX_S_N, SSUSB_TX_S_P, USB3_D_N, USB3_D_P, USB3_D_S_N, USB3_D_S_P
rule Matched Net Lengths [Tolerance = 100mil]: SSUSB_RX_N, SSUSB_RX_P, SSUSB_TX_N, SSUSB_TX_P, SSUSB_TX_S_N, SSUSB_TX_S_P, USB3_D_N, USB3_D_P, USB3_D_S_N, USB3_D_S_P

### Notes on the sheet
- (near J1) Console
- (near J1) 2.54mm
- (near U1) USB3.0

### Library data of the parts
C1-C3 = CAP
R1 R2 = Res
U1 = VUSB3-A-S-G-TB-FRA: USB 3 Type A Right Angle Vertical Socket
U2 = SP3012-06UTG: 7V _Typ_ Clamp 4A _8/20Âµs_ Ipp Tvs Diode Surface Mount 14-UDFN _3.5x1.35_; MF: Littelfuse Inc.; MP: SP3012-06UTG; Price: None; Availability: Unavailable; Package: UDFN-14 Littelfuse; SnapEDA_Link: https://www.snapeda.com/parts/SP3012-06UTG/Littelfuse%20Inc./view-part/481186/?ref=snap; Value: *

## Sheet uSD.SchDoc
size 386 x 246 mm
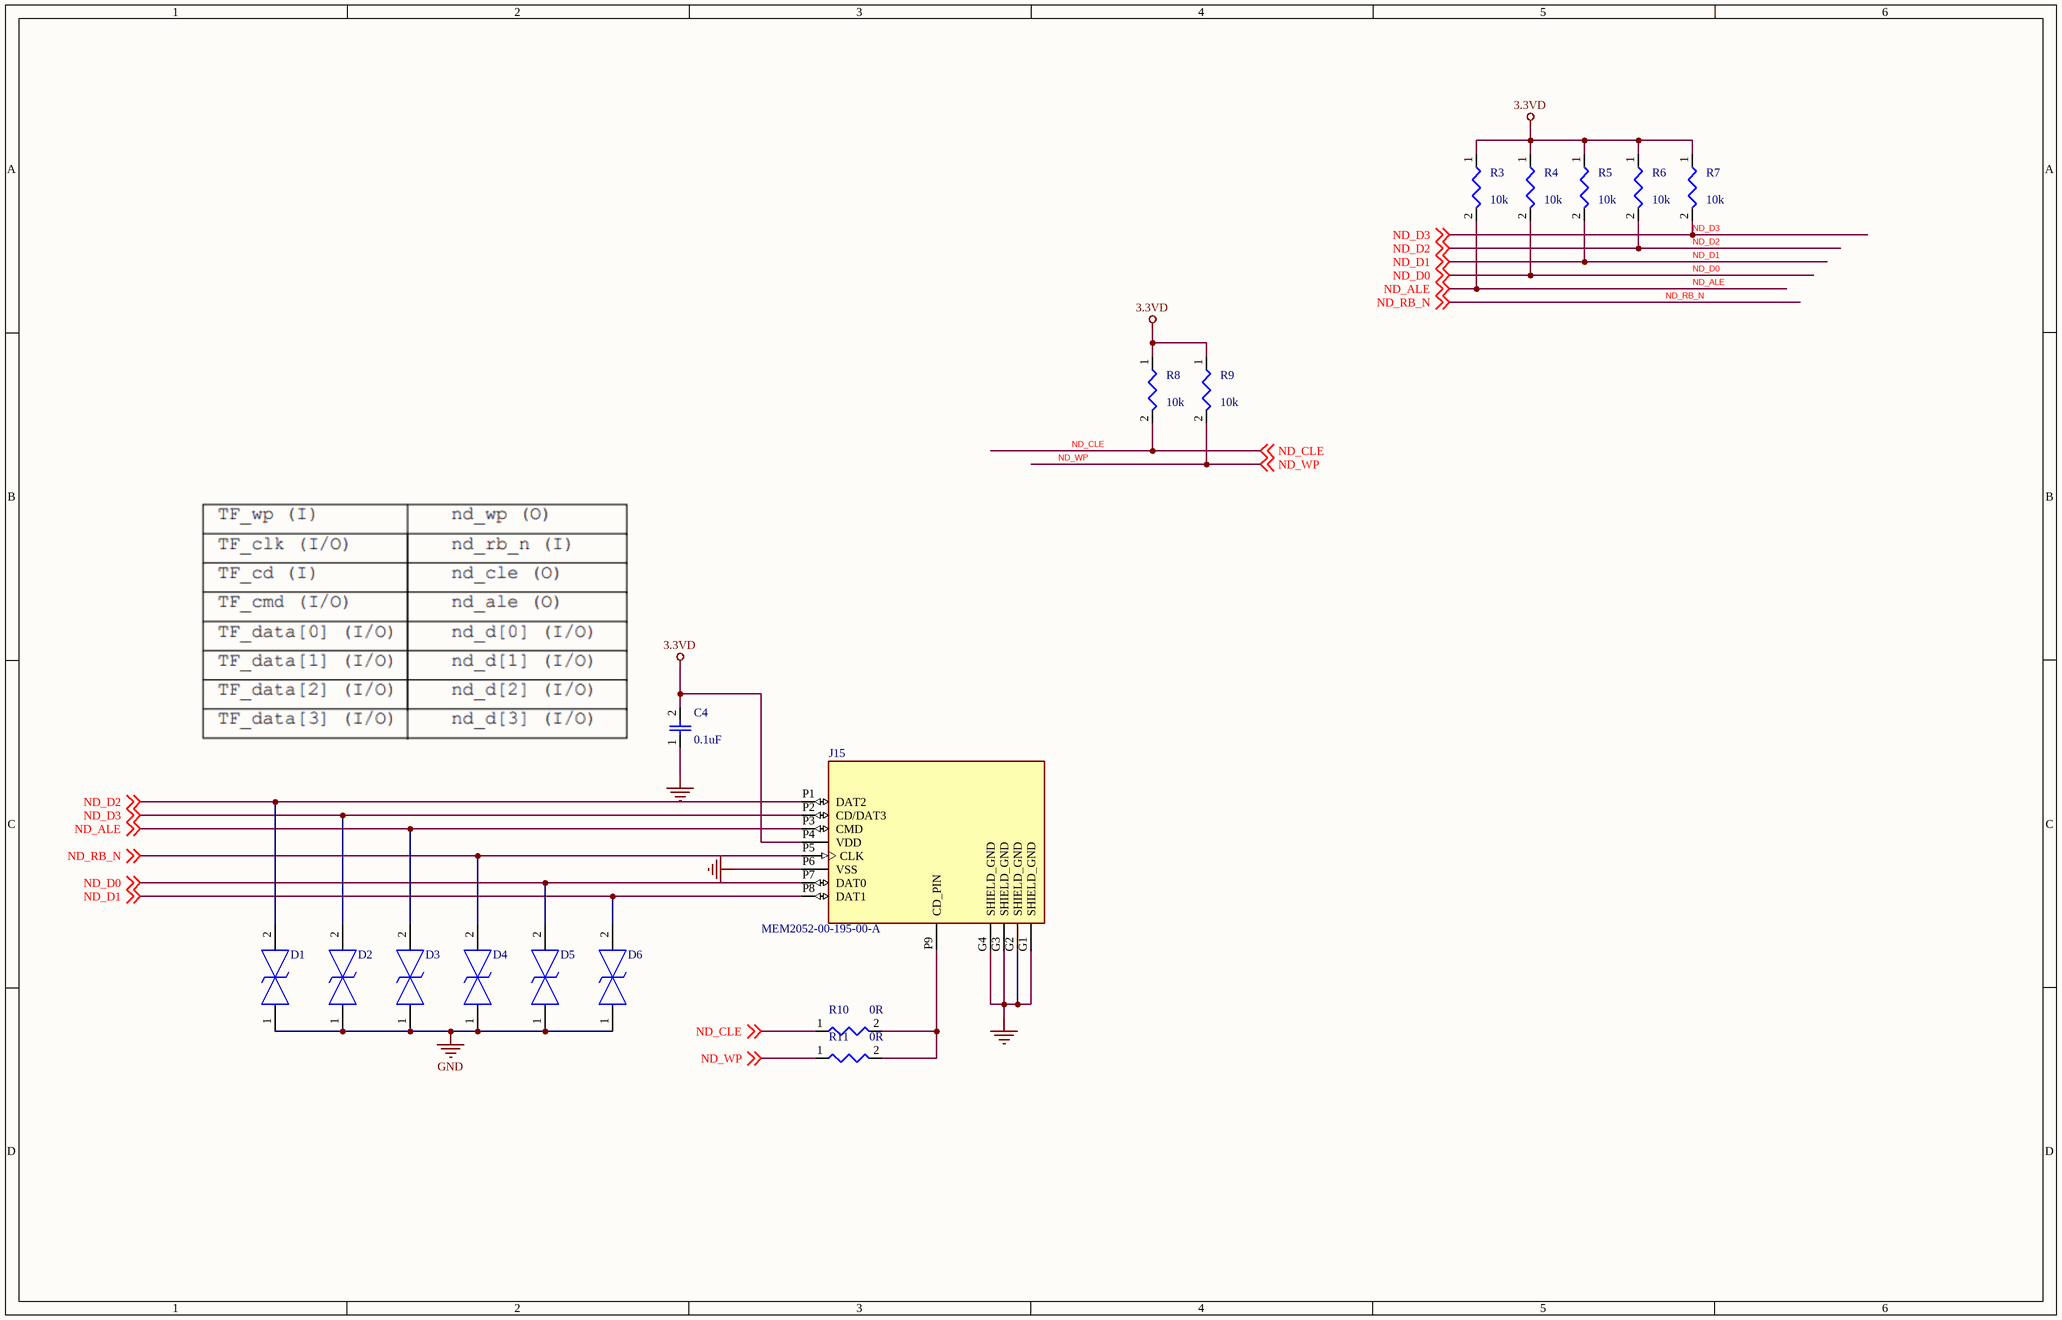
[diagram p5: uSD.SchDoc]

### Parts
C4  0.1uF  [0402-C]
D1  ESD9B5VL-2_TR  [ESD9B5VL2TR]  (value not drawn)
D2  ESD9B5VL-2_TR  [ESD9B5VL2TR]  (value not drawn)
D3  ESD9B5VL-2_TR  [ESD9B5VL2TR]  (value not drawn)
D4  ESD9B5VL-2_TR  [ESD9B5VL2TR]  (value not drawn)
D5  ESD9B5VL-2_TR  [ESD9B5VL2TR]  (value not drawn)
D6  ESD9B5VL-2_TR  [ESD9B5VL2TR]  (value not drawn)
J15  MEM2052-00-195-00-A  [GCT_MEM2052-00-195-00-A_REVA]
R3  10k  [0402-R]
R4  10k  [0402-R]
R5  10k  [0402-R]
R6  10k  [0402-R]
R7  10k  [0402-R]
R8  10k  [0402-R]
R9  10k  [0402-R]
R10  0R  [0402-R]
R11  0R  [0402-R]

### Nets
3.3VD: C4.2 J15.P4(VDD) R3.1 R4.1 R5.1 R6.1 R7.1 R8.1 R9.1
GND: C4.1 D1.1 D2.1 D3.1 D4.1 D5.1 D6.1 J15.G1(SHIELD_GND) J15.G2(SHIELD_GND) J15.G3(SHIELD_GND) J15.G4(SHIELD_GND) J15.P6(VSS)
ND_ALE: D3.2 J15.P3(CMD) R3.2 ; off-sheet ND_ALE
ND_CLE: R8.2 R10.1 ; off-sheet ND_CLE
ND_D0: D5.2 J15.P7(DAT0) R4.2 ; off-sheet ND_D0
ND_D1: D6.2 J15.P8(DAT1) R5.2 ; off-sheet ND_D1
ND_D2: D1.2 J15.P1(DAT2) R6.2 ; off-sheet ND_D2
ND_D3: D2.2 J15.P2(CD/DAT3) R7.2 ; off-sheet ND_D3
ND_RB_N: D4.2 J15.P5(CLK) ; off-sheet ND_RB_N
ND_WP: R9.2 R11.1 ; off-sheet ND_WP
NetJ15_P9: J15.P9(CD_PIN) R10.2 R11.2

### Library data of the parts
C4 = CAP
D1-D6 = ESD9B5VL-2_TR: TVS Diode (Bi-directional); Manufacturer_Name: Will Semiconductor; Manufacturer_Part_Number: ESD9B5VL-2/TR; Height: 0.55mm
J15 = MEM2052-00-195-00-A_REVA: MicroSD Push push Memory Card Connector; MF: Global Connector Technology; Package: None; Availability: Not in stock; SnapEDA_Link: https://www.snapeda.com/parts/MEM2052-00-195-00-A/Global+Connector+Technology/view-part/?ref=snap; MP: MEM2052-00-195-00-A; Price: None; Value: *; Check_prices: https://www.snapeda.com/parts/MEM2052-00-195-00-A/Global+Connector+Technology/view-part/?ref=eda
R3-R11 = Res